# EAGLE schematic core (EAGLE 9.6.2), part 1 of 2
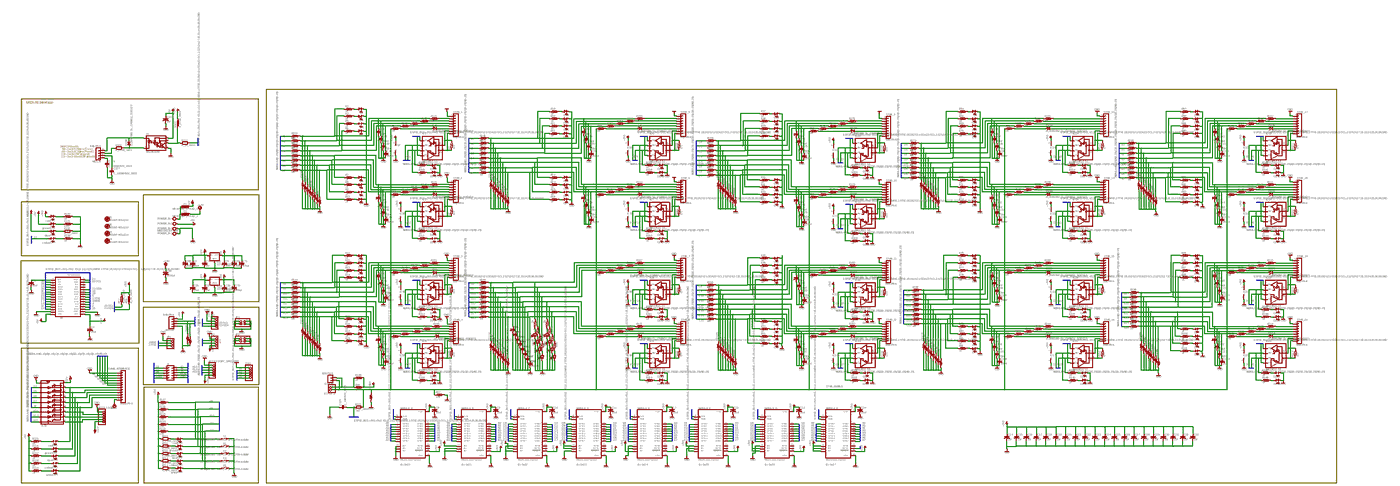
[diagram p0: schematic, sheet 1, overview]
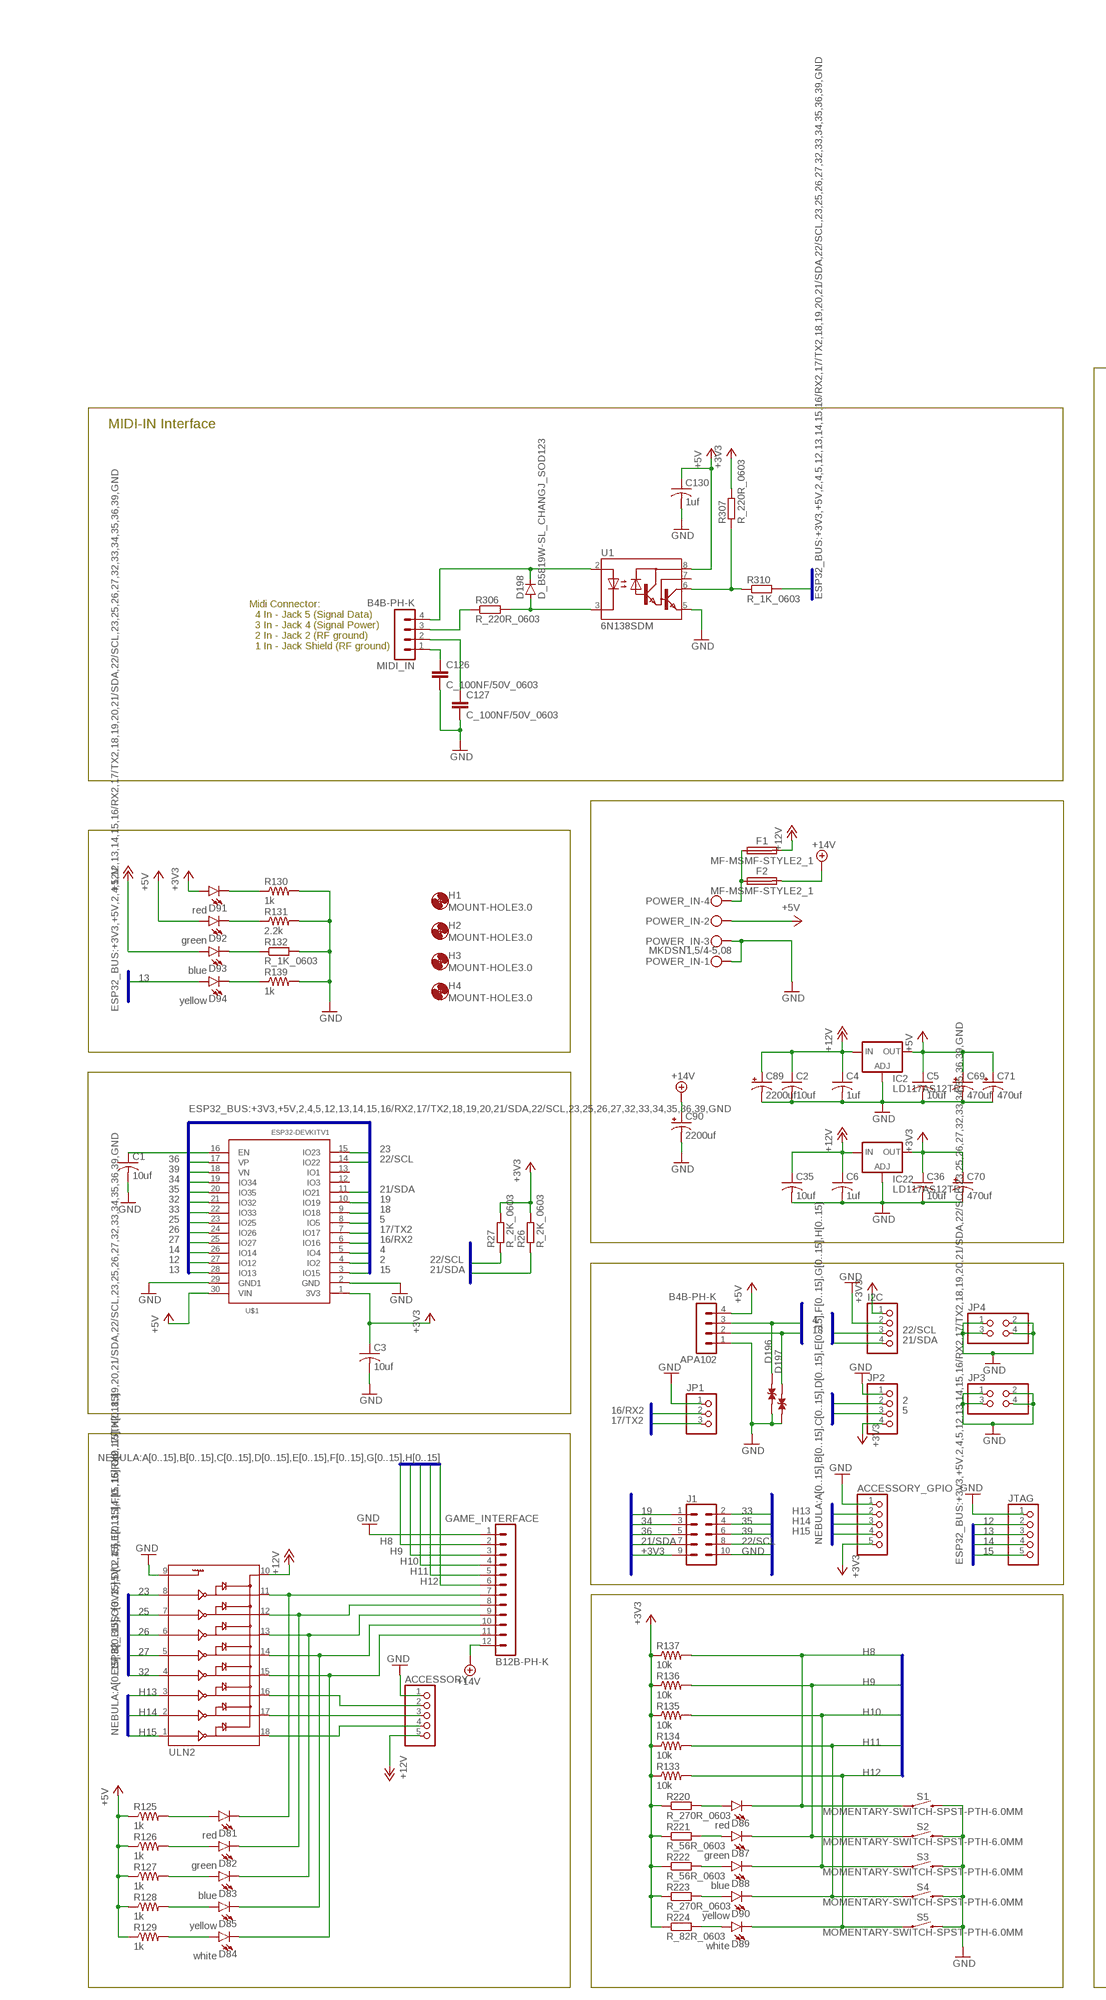
[diagram p1: schematic, sheet 1, part 1 of 4]
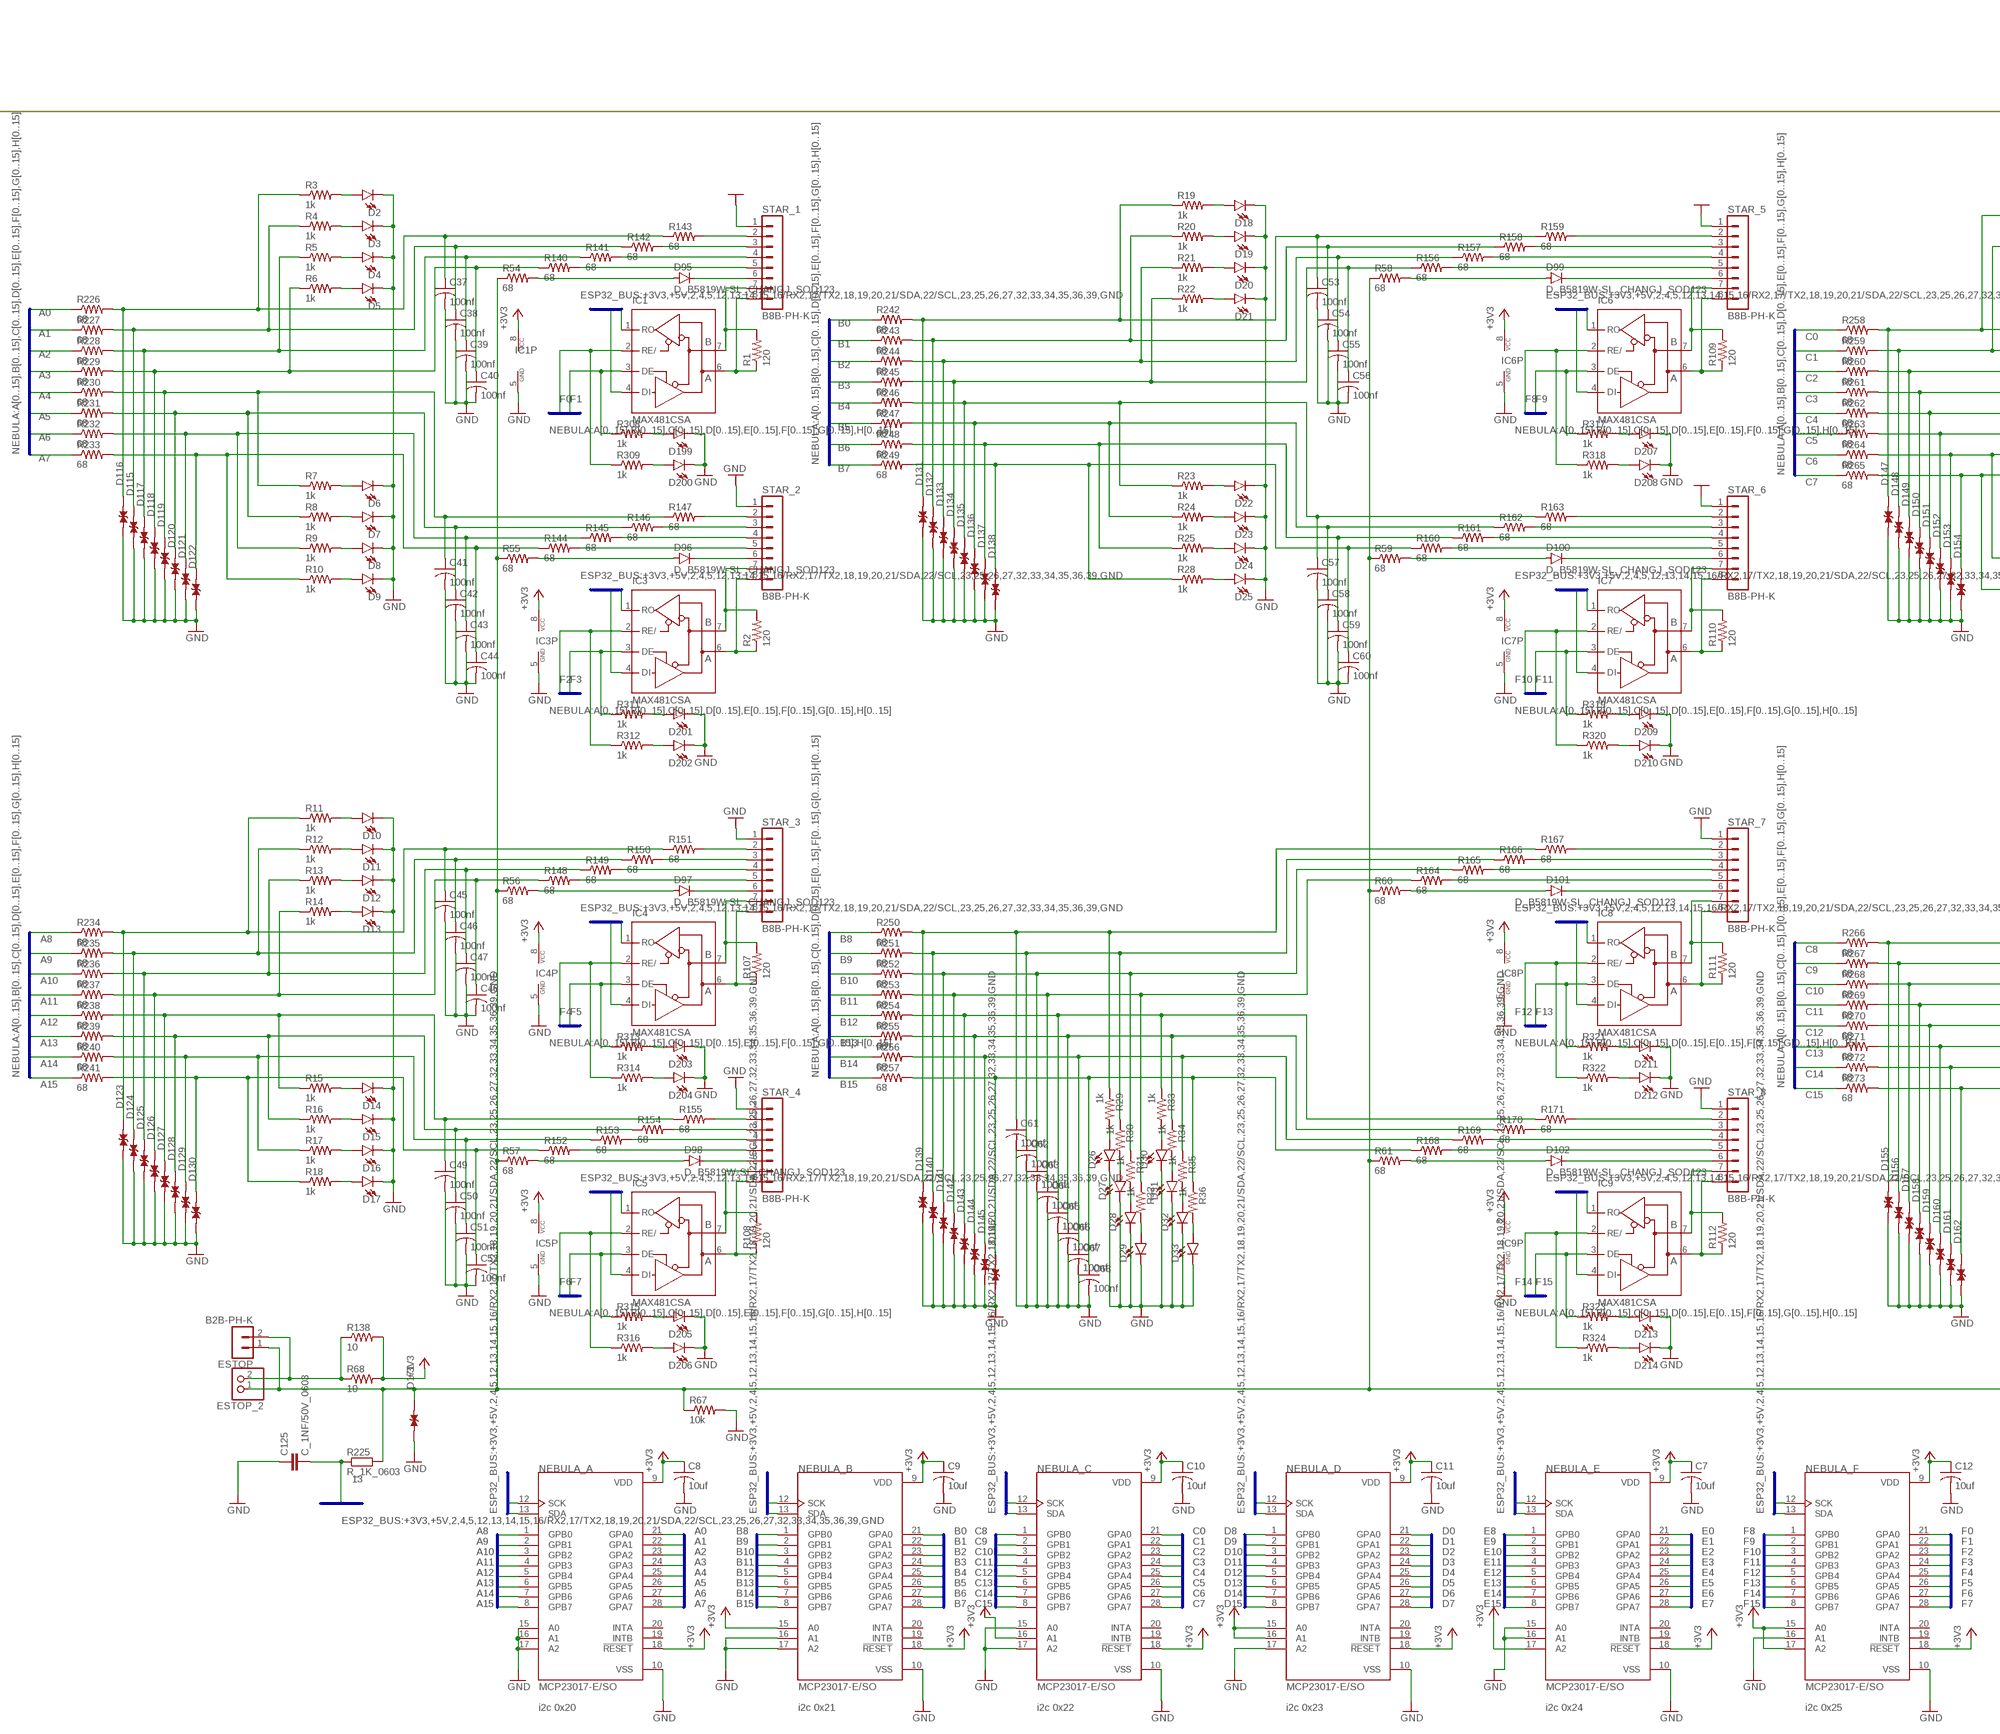
[diagram p2: schematic, sheet 1, part 2 of 4]
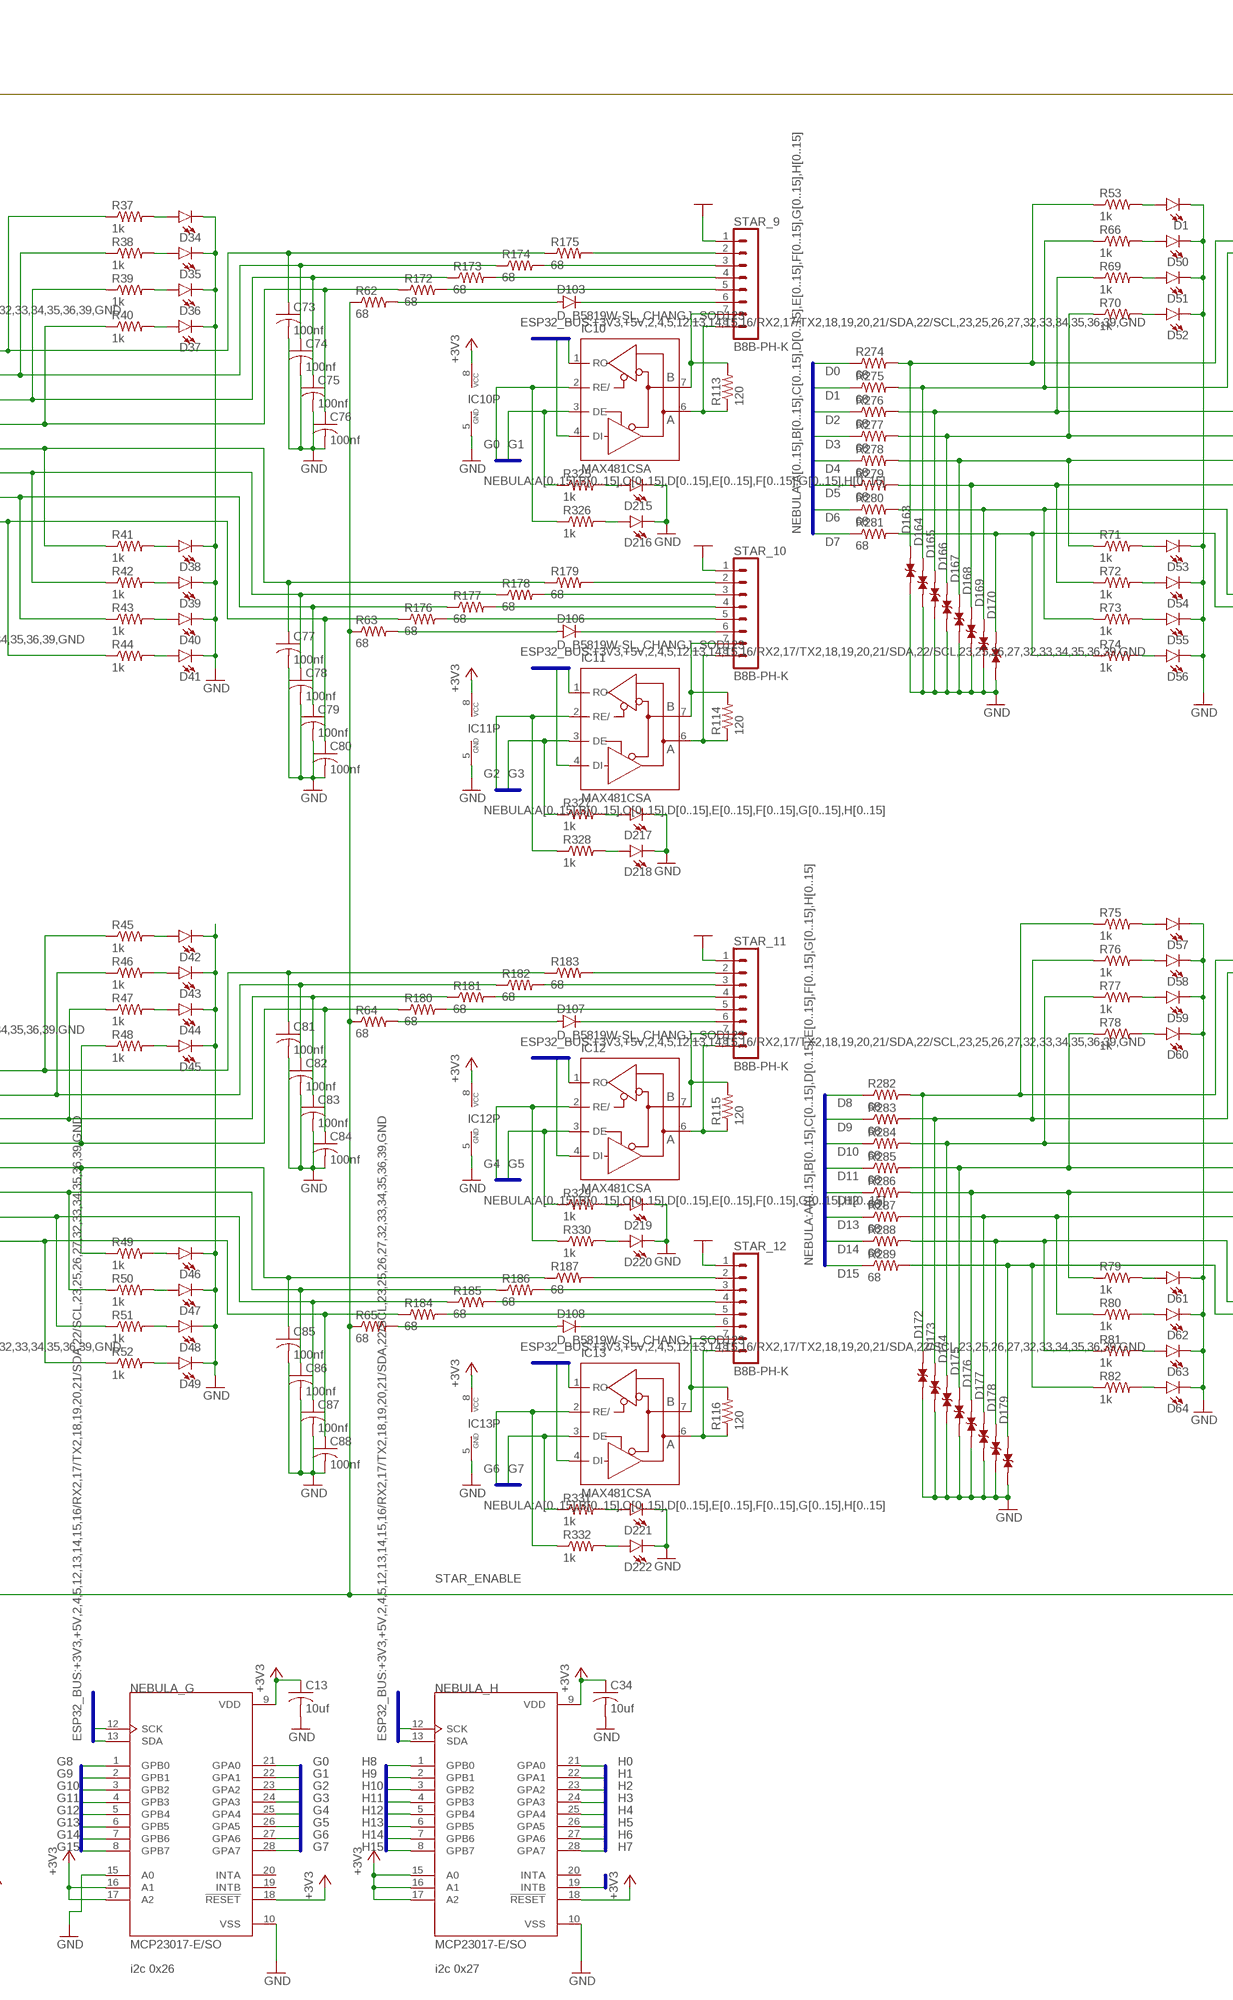
[diagram p3: schematic, sheet 1, part 3 of 4]
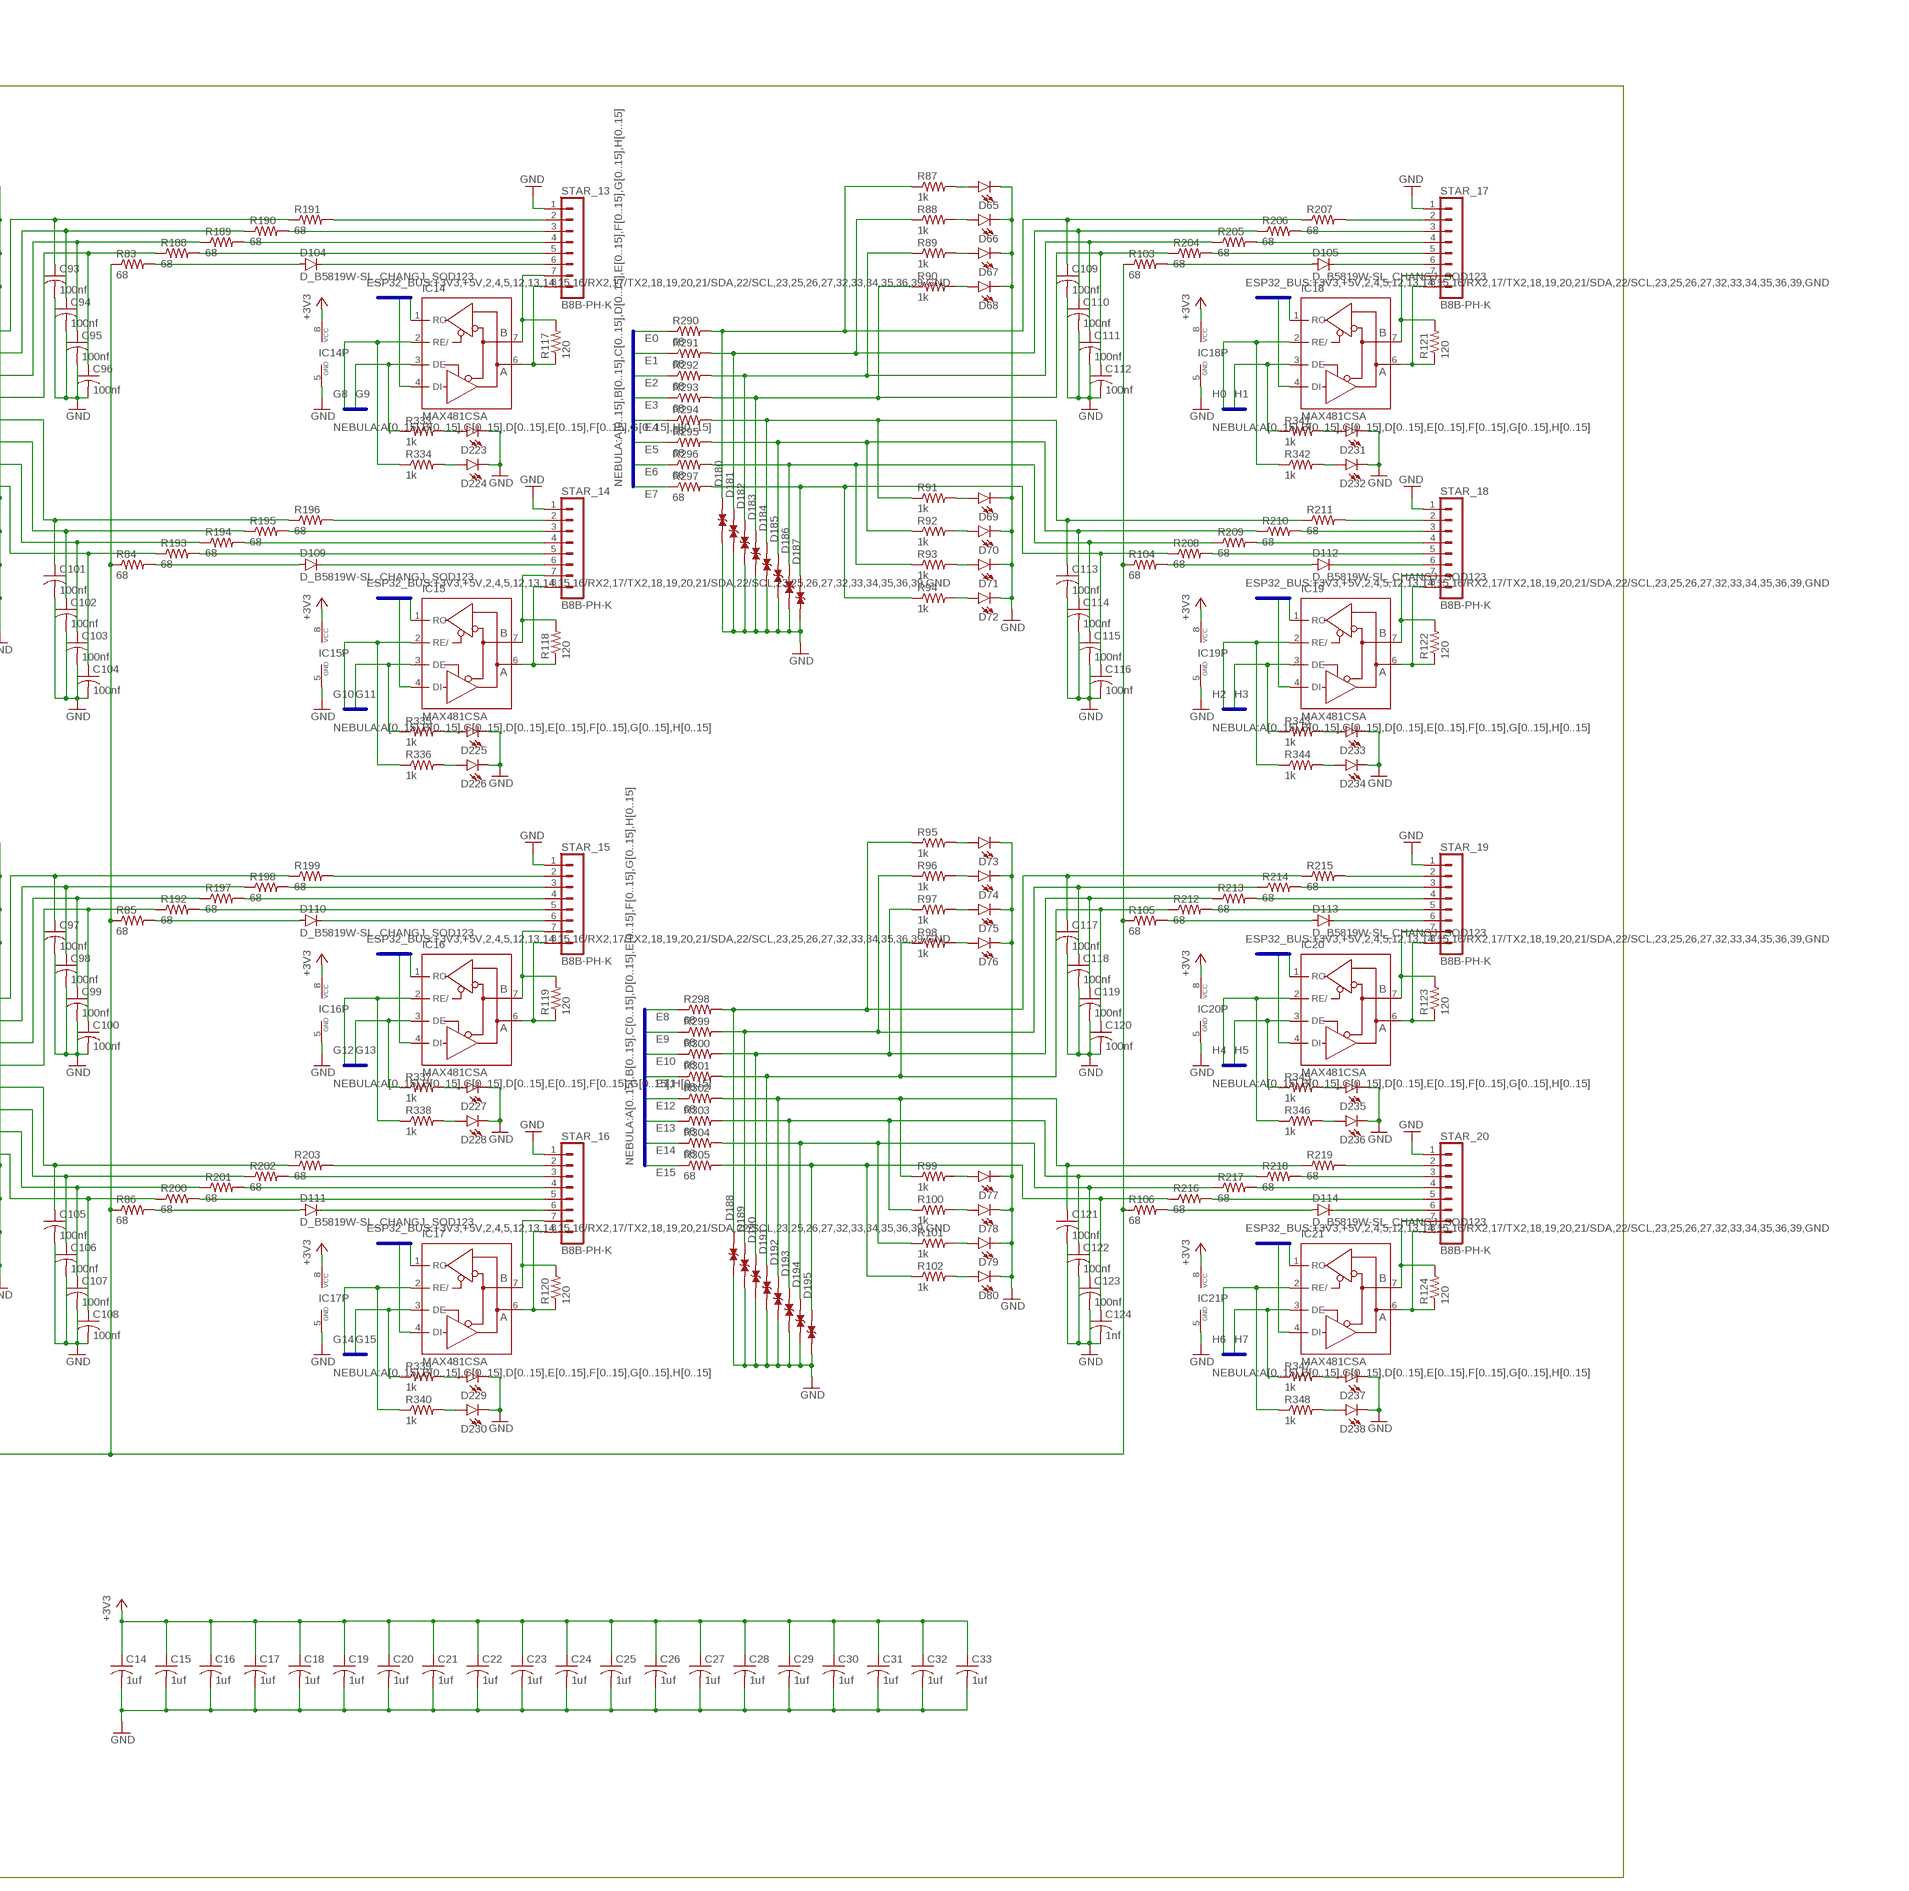
[diagram p4: schematic, sheet 1, part 4 of 4]

## Parts
ACCESSORY  PINHD-1X5  [1X05]
ACCESSORY_GPIO  PINHD-1X5  [1X05]
APA102  B4B-PH-K  [B4B-PH-K]
C1  10uf  C-USC0603  [C0603]
C2  10uf  C-USC0603  [C0603]
C3  10uf  C-USC0603  [C0603]
C4  1uf  C-USC0805  [C0805]
C5  10uf  C-USC0603  [C0603]
C6  1uf  C-USC0805  [C0805]
C7  10uf  C-USC0603  [C0603]
C8  10uf  C-USC0603  [C0603]
C9  10uf  C-USC0603  [C0603]
C10  10uf  C-USC0603  [C0603]
C11  10uf  C-USC0603  [C0603]
C12  10uf  C-USC0603  [C0603]
C13  10uf  C-USC0603  [C0603]
C14  1uf  C-USC0805  [C0805]
C15  1uf  C-USC0805  [C0805]
C16  1uf  C-USC0805  [C0805]
C17  1uf  C-USC0805  [C0805]
C18  1uf  C-USC0805  [C0805]
C19  1uf  C-USC0805  [C0805]
C20  1uf  C-USC0805  [C0805]
C21  1uf  C-USC0805  [C0805]
C22  1uf  C-USC0805  [C0805]
C23  1uf  C-USC0805  [C0805]
C24  1uf  C-USC0805  [C0805]
C25  1uf  C-USC0805  [C0805]
C26  1uf  C-USC0805  [C0805]
C27  1uf  C-USC0805  [C0805]
C28  1uf  C-USC0805  [C0805]
C29  1uf  C-USC0805  [C0805]
C30  1uf  C-USC0805  [C0805]
C31  1uf  C-USC0805  [C0805]
C32  1uf  C-USC0805  [C0805]
C33  1uf  C-USC0805  [C0805]
C34  10uf  C-USC0603  [C0603]
C35  10uf  C-USC0603  [C0603]
C36  10uf  C-USC0603  [C0603]
C37  100nf  C-USC0603  [C0603]
C38  100nf  C-USC0603  [C0603]
C39  100nf  C-USC0603  [C0603]
C40  100nf  C-USC0603  [C0603]
C41  100nf  C-USC0603  [C0603]
C42  100nf  C-USC0603  [C0603]
C43  100nf  C-USC0603  [C0603]
C44  100nf  C-USC0603  [C0603]
C45  100nf  C-USC0603  [C0603]
C46  100nf  C-USC0603  [C0603]
C47  100nf  C-USC0603  [C0603]
C48  100nf  C-USC0603  [C0603]
C49  100nf  C-USC0603  [C0603]
C50  100nf  C-USC0603  [C0603]
C51  100nf  C-USC0603  [C0603]
C52  100nf  C-USC0603  [C0603]
C53  100nf  C-USC0603  [C0603]
C54  100nf  C-USC0603  [C0603]
C55  100nf  C-USC0603  [C0603]
C56  100nf  C-USC0603  [C0603]
C57  100nf  C-USC0603  [C0603]
C58  100nf  C-USC0603  [C0603]
C59  100nf  C-USC0603  [C0603]
C60  100nf  C-USC0603  [C0603]
C61  100nf  C-USC0603  [C0603]
C62  100nf  C-USC0603  [C0603]
C63  100nf  C-USC0603  [C0603]
C64  100nf  C-USC0603  [C0603]
C65  100nf  C-USC0603  [C0603]
C66  100nf  C-USC0603  [C0603]
C67  100nf  C-USC0603  [C0603]
C68  100nf  C-USC0603  [C0603]
C69  470uf  CPOL-USE5-13  [E5-13]
C70  470uf  CPOL-USE5-13  [E5-13]
C71  470uf  CPOL-USE5-13  [E5-13]
C73  100nf  C-USC0603  [C0603]
C74  100nf  C-USC0603  [C0603]
C75  100nf  C-USC0603  [C0603]
C76  100nf  C-USC0603  [C0603]
C77  100nf  C-USC0603  [C0603]
C78  100nf  C-USC0603  [C0603]
C79  100nf  C-USC0603  [C0603]
C80  100nf  C-USC0603  [C0603]
C81  100nf  C-USC0603  [C0603]
C82  100nf  C-USC0603  [C0603]
C83  100nf  C-USC0603  [C0603]
C84  100nf  C-USC0603  [C0603]
C85  100nf  C-USC0603  [C0603]
C86  100nf  C-USC0603  [C0603]
C87  100nf  C-USC0603  [C0603]
C88  100nf  C-USC0603  [C0603]
C89  2200uf  CPOL-USE5-13  [E5-13]
C90  2200uf  CPOL-USE5-13  [E5-13]
C93  100nf  C-USC0603  [C0603]
C94  100nf  C-USC0603  [C0603]
C95  100nf  C-USC0603  [C0603]
C96  100nf  C-USC0603  [C0603]
C97  100nf  C-USC0603  [C0603]
C98  100nf  C-USC0603  [C0603]
C99  100nf  C-USC0603  [C0603]
C100  100nf  C-USC0603  [C0603]
C101  100nf  C-USC0603  [C0603]
C102  100nf  C-USC0603  [C0603]
C103  100nf  C-USC0603  [C0603]
C104  100nf  C-USC0603  [C0603]
C105  100nf  C-USC0603  [C0603]
C106  100nf  C-USC0603  [C0603]
C107  100nf  C-USC0603  [C0603]
C108  100nf  C-USC0603  [C0603]
C109  100nf  C-USC0603  [C0603]
C110  100nf  C-USC0603  [C0603]
C111  100nf  C-USC0603  [C0603]
C112  100nf  C-USC0603  [C0603]
C113  100nf  C-USC0603  [C0603]
C114  100nf  C-USC0603  [C0603]
C115  100nf  C-USC0603  [C0603]
C116  100nf  C-USC0603  [C0603]
C117  100nf  C-USC0603  [C0603]
C118  100nf  C-USC0603  [C0603]
C119  100nf  C-USC0603  [C0603]
C120  100nf  C-USC0603  [C0603]
C121  100nf  C-USC0603  [C0603]
C122  100nf  C-USC0603  [C0603]
C123  100nf  C-USC0603  [C0603]
C124  1nf  C-USC0603  [C0603]
C125  C_1NF/50V_0603  [C0603]
C126  C_100NF/50V_0603  [C0603]
C127  C_100NF/50V_0603  [C0603]
C130  1uf  C-USC0805  [C0805]
D1  LED0603  [LED-0603]
D2  LED0603  [LED-0603]
D3  LED0603  [LED-0603]
D4  LED0603  [LED-0603]
D5  LED0603  [LED-0603]
D6  LED0603  [LED-0603]
D7  LED0603  [LED-0603]
D8  LED0603  [LED-0603]
D9  LED0603  [LED-0603]
D10  LED0603  [LED-0603]
D11  LED0603  [LED-0603]
D12  LED0603  [LED-0603]
D13  LED0603  [LED-0603]
D14  LED0603  [LED-0603]
D15  LED0603  [LED-0603]
D16  LED0603  [LED-0603]
D17  LED0603  [LED-0603]
D18  LED0603  [LED-0603]
D19  LED0603  [LED-0603]
D20  LED0603  [LED-0603]
D21  LED0603  [LED-0603]
D22  LED0603  [LED-0603]
D23  LED0603  [LED-0603]
D24  LED0603  [LED-0603]
D25  LED0603  [LED-0603]
D26  LED0603  [LED-0603]
D27  LED0603  [LED-0603]
D28  LED0603  [LED-0603]
D29  LED0603  [LED-0603]
D30  LED0603  [LED-0603]
D31  LED0603  [LED-0603]
D32  LED0603  [LED-0603]
D33  LED0603  [LED-0603]
D34  LED0603  [LED-0603]
D35  LED0603  [LED-0603]
D36  LED0603  [LED-0603]
D37  LED0603  [LED-0603]
D38  LED0603  [LED-0603]
D39  LED0603  [LED-0603]
D40  LED0603  [LED-0603]
D41  LED0603  [LED-0603]
D42  LED0603  [LED-0603]
D43  LED0603  [LED-0603]
D44  LED0603  [LED-0603]
D45  LED0603  [LED-0603]
D46  LED0603  [LED-0603]
D47  LED0603  [LED-0603]
D48  LED0603  [LED-0603]
D49  LED0603  [LED-0603]
D50  LED0603  [LED-0603]
D51  LED0603  [LED-0603]
D52  LED0603  [LED-0603]
D53  LED0603  [LED-0603]
D54  LED0603  [LED-0603]
D55  LED0603  [LED-0603]
D56  LED0603  [LED-0603]
D57  LED0603  [LED-0603]
D58  LED0603  [LED-0603]
D59  LED0603  [LED-0603]
D60  LED0603  [LED-0603]
D61  LED0603  [LED-0603]
D62  LED0603  [LED-0603]
D63  LED0603  [LED-0603]
D64  LED0603  [LED-0603]
D65  LED0603  [LED-0603]
D66  LED0603  [LED-0603]
D67  LED0603  [LED-0603]
D68  LED0603  [LED-0603]
D69  LED0603  [LED-0603]
D70  LED0603  [LED-0603]
D71  LED0603  [LED-0603]
D72  LED0603  [LED-0603]
D73  LED0603  [LED-0603]
D74  LED0603  [LED-0603]
D75  LED0603  [LED-0603]
D76  LED0603  [LED-0603]
D77  LED0603  [LED-0603]
D78  LED0603  [LED-0603]
D79  LED0603  [LED-0603]
D80  LED0603  [LED-0603]
D81  red  LED0603  [LED-0603]
D82  green  LED0603  [LED-0603]
D83  blue  LED0603  [LED-0603]
D84  white  LED0603  [LED-0603]
D85  yellow  LED0603  [LED-0603]
D86  red  LED0603  [LED-0603]
D87  green  LED0603  [LED-0603]
D88  blue  LED0603  [LED-0603]
D89  white  LED0603  [LED-0603]
D90  yellow  LED0603  [LED-0603]
D91  red  LED0603  [LED-0603]
D92  green  LED0603  [LED-0603]
D93  blue  LED0603  [LED-0603]
D94  yellow  LED0603  [LED-0603]
D95  D_B5819W-SL_CHANGJ_SOD123  [SOD123]
D96  D_B5819W-SL_CHANGJ_SOD123  [SOD123]
D97  D_B5819W-SL_CHANGJ_SOD123  [SOD123]
D98  D_B5819W-SL_CHANGJ_SOD123  [SOD123]
D99  D_B5819W-SL_CHANGJ_SOD123  [SOD123]
D100  D_B5819W-SL_CHANGJ_SOD123  [SOD123]
D101  D_B5819W-SL_CHANGJ_SOD123  [SOD123]
D102  D_B5819W-SL_CHANGJ_SOD123  [SOD123]
D103  D_B5819W-SL_CHANGJ_SOD123  [SOD123]
D104  D_B5819W-SL_CHANGJ_SOD123  [SOD123]
D105  D_B5819W-SL_CHANGJ_SOD123  [SOD123]
D106  D_B5819W-SL_CHANGJ_SOD123  [SOD123]
D107  D_B5819W-SL_CHANGJ_SOD123  [SOD123]
D108  D_B5819W-SL_CHANGJ_SOD123  [SOD123]
D109  D_B5819W-SL_CHANGJ_SOD123  [SOD123]
D110  D_B5819W-SL_CHANGJ_SOD123  [SOD123]
D111  D_B5819W-SL_CHANGJ_SOD123  [SOD123]
D112  D_B5819W-SL_CHANGJ_SOD123  [SOD123]
D113  D_B5819W-SL_CHANGJ_SOD123  [SOD123]
D114  D_B5819W-SL_CHANGJ_SOD123  [SOD123]
D115  SMBJ8.0CA  [DIOM4336X265N]
D116  SMBJ8.0CA  [DIOM4336X265N]
D117  SMBJ8.0CA  [DIOM4336X265N]
D118  SMBJ8.0CA  [DIOM4336X265N]
D119  SMBJ8.0CA  [DIOM4336X265N]
D120  SMBJ8.0CA  [DIOM4336X265N]
D121  SMBJ8.0CA  [DIOM4336X265N]
D122  SMBJ8.0CA  [DIOM4336X265N]
D123  SMBJ8.0CA  [DIOM4336X265N]
D124  SMBJ8.0CA  [DIOM4336X265N]
D125  SMBJ8.0CA  [DIOM4336X265N]
D126  SMBJ8.0CA  [DIOM4336X265N]
D127  SMBJ8.0CA  [DIOM4336X265N]
D128  SMBJ8.0CA  [DIOM4336X265N]
D129  SMBJ8.0CA  [DIOM4336X265N]
D130  SMBJ8.0CA  [DIOM4336X265N]
D131  SMBJ8.0CA  [DIOM4336X265N]
D132  SMBJ8.0CA  [DIOM4336X265N]
D133  SMBJ8.0CA  [DIOM4336X265N]
D134  SMBJ8.0CA  [DIOM4336X265N]
D135  SMBJ8.0CA  [DIOM4336X265N]
D136  SMBJ8.0CA  [DIOM4336X265N]
D137  SMBJ8.0CA  [DIOM4336X265N]
D138  SMBJ8.0CA  [DIOM4336X265N]
D139  SMBJ8.0CA  [DIOM4336X265N]
D140  SMBJ8.0CA  [DIOM4336X265N]
D141  SMBJ8.0CA  [DIOM4336X265N]
D142  SMBJ8.0CA  [DIOM4336X265N]
D143  SMBJ8.0CA  [DIOM4336X265N]
D144  SMBJ8.0CA  [DIOM4336X265N]
D145  SMBJ8.0CA  [DIOM4336X265N]
D146  SMBJ8.0CA  [DIOM4336X265N]
D147  SMBJ8.0CA  [DIOM4336X265N]
D148  SMBJ8.0CA  [DIOM4336X265N]
D149  SMBJ8.0CA  [DIOM4336X265N]
D150  SMBJ8.0CA  [DIOM4336X265N]
D151  SMBJ8.0CA  [DIOM4336X265N]
D152  SMBJ8.0CA  [DIOM4336X265N]
D153  SMBJ8.0CA  [DIOM4336X265N]
D154  SMBJ8.0CA  [DIOM4336X265N]
D155  SMBJ8.0CA  [DIOM4336X265N]
D156  SMBJ8.0CA  [DIOM4336X265N]
D157  SMBJ8.0CA  [DIOM4336X265N]
D158  SMBJ8.0CA  [DIOM4336X265N]
D159  SMBJ8.0CA  [DIOM4336X265N]
D160  SMBJ8.0CA  [DIOM4336X265N]
D161  SMBJ8.0CA  [DIOM4336X265N]
D162  SMBJ8.0CA  [DIOM4336X265N]
D163  SMBJ8.0CA  [DIOM4336X265N]
D164  SMBJ8.0CA  [DIOM4336X265N]
D165  SMBJ8.0CA  [DIOM4336X265N]
D166  SMBJ8.0CA  [DIOM4336X265N]
D167  SMBJ8.0CA  [DIOM4336X265N]
D168  SMBJ8.0CA  [DIOM4336X265N]
D169  SMBJ8.0CA  [DIOM4336X265N]
D170  SMBJ8.0CA  [DIOM4336X265N]
D171  SMBJ8.0CA  [DIOM4336X265N]
D172  SMBJ8.0CA  [DIOM4336X265N]
D173  SMBJ8.0CA  [DIOM4336X265N]
D174  SMBJ8.0CA  [DIOM4336X265N]
D175  SMBJ8.0CA  [DIOM4336X265N]
D176  SMBJ8.0CA  [DIOM4336X265N]
D177  SMBJ8.0CA  [DIOM4336X265N]
D178  SMBJ8.0CA  [DIOM4336X265N]
D179  SMBJ8.0CA  [DIOM4336X265N]
D180  SMBJ8.0CA  [DIOM4336X265N]
D181  SMBJ8.0CA  [DIOM4336X265N]
D182  SMBJ8.0CA  [DIOM4336X265N]
D183  SMBJ8.0CA  [DIOM4336X265N]
D184  SMBJ8.0CA  [DIOM4336X265N]
D185  SMBJ8.0CA  [DIOM4336X265N]
D186  SMBJ8.0CA  [DIOM4336X265N]
D187  SMBJ8.0CA  [DIOM4336X265N]
D188  SMBJ8.0CA  [DIOM4336X265N]
D189  SMBJ8.0CA  [DIOM4336X265N]
D190  SMBJ8.0CA  [DIOM4336X265N]
D191  SMBJ8.0CA  [DIOM4336X265N]
D192  SMBJ8.0CA  [DIOM4336X265N]
D193  SMBJ8.0CA  [DIOM4336X265N]
D194  SMBJ8.0CA  [DIOM4336X265N]
D195  SMBJ8.0CA  [DIOM4336X265N]
D196  SMBJ8.0CA  [DIOM4336X265N]
D197  SMBJ8.0CA  [DIOM4336X265N]
D198  D_B5819W-SL_CHANGJ_SOD123  [SOD123]
D199  LED0603  [LED-0603]
D200  LED0603  [LED-0603]
D201  LED0603  [LED-0603]
D202  LED0603  [LED-0603]
D203  LED0603  [LED-0603]
D204  LED0603  [LED-0603]
D205  LED0603  [LED-0603]
D206  LED0603  [LED-0603]
D207  LED0603  [LED-0603]
D208  LED0603  [LED-0603]
D209  LED0603  [LED-0603]
D210  LED0603  [LED-0603]
D211  LED0603  [LED-0603]
D212  LED0603  [LED-0603]
D213  LED0603  [LED-0603]
D214  LED0603  [LED-0603]
D215  LED0603  [LED-0603]
D216  LED0603  [LED-0603]
D217  LED0603  [LED-0603]
D218  LED0603  [LED-0603]
D219  LED0603  [LED-0603]
D220  LED0603  [LED-0603]
D221  LED0603  [LED-0603]
D222  LED0603  [LED-0603]
D223  LED0603  [LED-0603]
D224  LED0603  [LED-0603]
D225  LED0603  [LED-0603]
D226  LED0603  [LED-0603]
D227  LED0603  [LED-0603]
D228  LED0603  [LED-0603]
D229  LED0603  [LED-0603]
D230  LED0603  [LED-0603]
D231  LED0603  [LED-0603]
D232  LED0603  [LED-0603]
D233  LED0603  [LED-0603]
D234  LED0603  [LED-0603]
D235  LED0603  [LED-0603]
D236  LED0603  [LED-0603]
D237  LED0603  [LED-0603]
D238  LED0603  [LED-0603]
ESTOP  B2B-PH-K  [B2B-PH-K]
ESTOP_2  PINHD-1X2  [1X02]
F1  MF-MSMF-STYLE2_1  [FUSC4632X160]
F2  MF-MSMF-STYLE2_1  [FUSC4632X160]
GAME_INTERFACE  B12B-PH-K  [B12B-PH-K]
H1  MOUNT-HOLE3.0  [3,0]
H2  MOUNT-HOLE3.0  [3,0]
H3  MOUNT-HOLE3.0  [3,0]
H4  MOUNT-HOLE3.0  [3,0]
I2C  PINHD-1X4  [1X04]
IC1  MAX481CSA  [SO08]
IC2  LD117AS12TR  [SOT223]
IC3  MAX481CSA  [SO08]
IC4  MAX481CSA  [SO08]
IC5  MAX481CSA  [SO08]
IC6  MAX481CSA  [SO08]
IC7  MAX481CSA  [SO08]
IC8  MAX481CSA  [SO08]
IC9  MAX481CSA  [SO08]
IC10  MAX481CSA  [SO08]
IC11  MAX481CSA  [SO08]
IC12  MAX481CSA  [SO08]
IC13  MAX481CSA  [SO08]
IC14  MAX481CSA  [SO08]
IC15  MAX481CSA  [SO08]
IC16  MAX481CSA  [SO08]
IC17  MAX481CSA  [SO08]
IC18  MAX481CSA  [SO08]
IC19  MAX481CSA  [SO08]
IC20  MAX481CSA  [SO08]
IC21  MAX481CSA  [SO08]
IC22  LD117AS12TR  [SOT223]
J1  CONN_05X2SHD  [2X5-SHROUDED]
JP1  PINHD-1X3  [1X03]
JP2  PINHD-1X4  [1X04]
JP3  PINHD-2X2  [2X02]
JP4  PINHD-2X2  [2X02]
JTAG  PINHD-1X5  [1X05]
MIDI_IN  B4B-PH-K  [B4B-PH-K]
NEBULA_A  MCP23017-E/SO  [SOIC127P1030X265-28N]
NEBULA_B  MCP23017-E/SO  [SOIC127P1030X265-28N]
NEBULA_C  MCP23017-E/SO  [SOIC127P1030X265-28N]
NEBULA_D  MCP23017-E/SO  [SOIC127P1030X265-28N]
NEBULA_E  MCP23017-E/SO  [SOIC127P1030X265-28N]
NEBULA_F  MCP23017-E/SO  [SOIC127P1030X265-28N]
NEBULA_G  MCP23017-E/SO  [SOIC127P1030X265-28N]
NEBULA_H  MCP23017-E/SO  [SOIC127P1030X265-28N]
POWER_IN  MKDSN1,5/4-5,08  [MKDSN1,5/4-5,08]
R1  120  R-US_R0603  [R0603]
R2  120  R-US_R0603  [R0603]
R3  1k  R-US_R0603  [R0603]
R4  1k  R-US_R0603  [R0603]
R5  1k  R-US_R0603  [R0603]
R6  1k  R-US_R0603  [R0603]
R7  1k  R-US_R0603  [R0603]
R8  1k  R-US_R0603  [R0603]
R9  1k  R-US_R0603  [R0603]
R10  1k  R-US_R0603  [R0603]
R11  1k  R-US_R0603  [R0603]
R12  1k  R-US_R0603  [R0603]
R13  1k  R-US_R0603  [R0603]
R14  1k  R-US_R0603  [R0603]
R15  1k  R-US_R0603  [R0603]
R16  1k  R-US_R0603  [R0603]
R17  1k  R-US_R0603  [R0603]
R18  1k  R-US_R0603  [R0603]
R19  1k  R-US_R0603  [R0603]
R20  1k  R-US_R0603  [R0603]
R21  1k  R-US_R0603  [R0603]
R22  1k  R-US_R0603  [R0603]
R23  1k  R-US_R0603  [R0603]
R24  1k  R-US_R0603  [R0603]
R25  1k  R-US_R0603  [R0603]
R26  R_2K_0603  [R0603]
R27  R_2K_0603  [R0603]
R28  1k  R-US_R0603  [R0603]
R29  1k  R-US_R0603  [R0603]
R30  1k  R-US_R0603  [R0603]
R31  1k  R-US_R0603  [R0603]
R32  1k  R-US_R0603  [R0603]
R33  1k  R-US_R0603  [R0603]
R34  1k  R-US_R0603  [R0603]
R35  1k  R-US_R0603  [R0603]
R36  1k  R-US_R0603  [R0603]
R37  1k  R-US_R0603  [R0603]
R38  1k  R-US_R0603  [R0603]
R39  1k  R-US_R0603  [R0603]
R40  1k  R-US_R0603  [R0603]
R41  1k  R-US_R0603  [R0603]
R42  1k  R-US_R0603  [R0603]
R43  1k  R-US_R0603  [R0603]
R44  1k  R-US_R0603  [R0603]
R45  1k  R-US_R0603  [R0603]
R46  1k  R-US_R0603  [R0603]
R47  1k  R-US_R0603  [R0603]
R48  1k  R-US_R0603  [R0603]
R49  1k  R-US_R0603  [R0603]
R50  1k  R-US_R0603  [R0603]
R51  1k  R-US_R0603  [R0603]
R52  1k  R-US_R0603  [R0603]
R53  1k  R-US_R0603  [R0603]
R54  68  R-US_R0603  [R0603]
R55  68  R-US_R0603  [R0603]
R56  68  R-US_R0603  [R0603]
R57  68  R-US_R0603  [R0603]
R58  68  R-US_R0603  [R0603]
R59  68  R-US_R0603  [R0603]
R60  68  R-US_R0603  [R0603]
R61  68  R-US_R0603  [R0603]
R62  68  R-US_R0603  [R0603]
R63  68  R-US_R0603  [R0603]
R64  68  R-US_R0603  [R0603]
R65  68  R-US_R0603  [R0603]
R66  1k  R-US_R0603  [R0603]
R67  10k  R-US_R0603  [R0603]
R68  10  R-US_R1206  [R1206]
R69  1k  R-US_R0603  [R0603]
R70  1k  R-US_R0603  [R0603]
R71  1k  R-US_R0603  [R0603]
R72  1k  R-US_R0603  [R0603]
R73  1k  R-US_R0603  [R0603]
R74  1k  R-US_R0603  [R0603]
R75  1k  R-US_R0603  [R0603]
R76  1k  R-US_R0603  [R0603]
R77  1k  R-US_R0603  [R0603]
R78  1k  R-US_R0603  [R0603]
R79  1k  R-US_R0603  [R0603]
R80  1k  R-US_R0603  [R0603]
R81  1k  R-US_R0603  [R0603]
R82  1k  R-US_R0603  [R0603]
R83  68  R-US_R0603  [R0603]
R84  68  R-US_R0603  [R0603]
R85  68  R-US_R0603  [R0603]
R86  68  R-US_R0603  [R0603]
R87  1k  R-US_R0603  [R0603]
R88  1k  R-US_R0603  [R0603]
R89  1k  R-US_R0603  [R0603]
R90  1k  R-US_R0603  [R0603]
R91  1k  R-US_R0603  [R0603]
R92  1k  R-US_R0603  [R0603]
R93  1k  R-US_R0603  [R0603]
R94  1k  R-US_R0603  [R0603]
R95  1k  R-US_R0603  [R0603]
R96  1k  R-US_R0603  [R0603]
R97  1k  R-US_R0603  [R0603]
R98  1k  R-US_R0603  [R0603]
R99  1k  R-US_R0603  [R0603]
R100  1k  R-US_R0603  [R0603]
R101  1k  R-US_R0603  [R0603]
R102  1k  R-US_R0603  [R0603]
R103  68  R-US_R0603  [R0603]
R104  68  R-US_R0603  [R0603]
R105  68  R-US_R0603  [R0603]
R106  68  R-US_R0603  [R0603]
R107  120  R-US_R0603  [R0603]
R108  120  R-US_R0603  [R0603]
R109  120  R-US_R0603  [R0603]
R110  120  R-US_R0603  [R0603]
R111  120  R-US_R0603  [R0603]
R112  120  R-US_R0603  [R0603]
R113  120  R-US_R0603  [R0603]
R114  120  R-US_R0603  [R0603]
R115  120  R-US_R0603  [R0603]
R116  120  R-US_R0603  [R0603]
R117  120  R-US_R0603  [R0603]
R118  120  R-US_R0603  [R0603]
R119  120  R-US_R0603  [R0603]
R120  120  R-US_R0603  [R0603]
R121  120  R-US_R0603  [R0603]
R122  120  R-US_R0603  [R0603]
R123  120  R-US_R0603  [R0603]
R124  120  R-US_R0603  [R0603]
R125  1k  R-US_R0603  [R0603]
R126  1k  R-US_R0603  [R0603]
R127  1k  R-US_R0603  [R0603]
R128  1k  R-US_R0603  [R0603]
R129  1k  R-US_R0603  [R0603]
R130  1k  R-US_R0603  [R0603]
R131  2.2k  R-US_R0603  [R0603]
R132  R_1K_0603  [R0603]
R133  10k  R-US_R0603  [R0603]
R134  10k  R-US_R0603  [R0603]
R135  10k  R-US_R0603  [R0603]
R136  10k  R-US_R0603  [R0603]
R137  10k  R-US_R0603  [R0603]
R138  10  R-US_R1206  [R1206]
R139  1k  R-US_R0603  [R0603]
R140  68  R-US_R0603  [R0603]
R141  68  R-US_R0603  [R0603]
R142  68  R-US_R0603  [R0603]
R143  68  R-US_R0603  [R0603]
R144  68  R-US_R0603  [R0603]
R145  68  R-US_R0603  [R0603]
R146  68  R-US_R0603  [R0603]
R147  68  R-US_R0603  [R0603]
R148  68  R-US_R0603  [R0603]
R149  68  R-US_R0603  [R0603]
R150  68  R-US_R0603  [R0603]
R151  68  R-US_R0603  [R0603]
R152  68  R-US_R0603  [R0603]
R153  68  R-US_R0603  [R0603]
R154  68  R-US_R0603  [R0603]
R155  68  R-US_R0603  [R0603]
R156  68  R-US_R0603  [R0603]
R157  68  R-US_R0603  [R0603]
R158  68  R-US_R0603  [R0603]
R159  68  R-US_R0603  [R0603]
R160  68  R-US_R0603  [R0603]
R161  68  R-US_R0603  [R0603]
R162  68  R-US_R0603  [R0603]
R163  68  R-US_R0603  [R0603]
R164  68  R-US_R0603  [R0603]
R165  68  R-US_R0603  [R0603]
R166  68  R-US_R0603  [R0603]
R167  68  R-US_R0603  [R0603]
R168  68  R-US_R0603  [R0603]
R169  68  R-US_R0603  [R0603]
R170  68  R-US_R0603  [R0603]
R171  68  R-US_R0603  [R0603]
R172  68  R-US_R0603  [R0603]
R173  68  R-US_R0603  [R0603]
R174  68  R-US_R0603  [R0603]
R175  68  R-US_R0603  [R0603]
R176  68  R-US_R0603  [R0603]
R177  68  R-US_R0603  [R0603]
R178  68  R-US_R0603  [R0603]
R179  68  R-US_R0603  [R0603]
R180  68  R-US_R0603  [R0603]
R181  68  R-US_R0603  [R0603]
R182  68  R-US_R0603  [R0603]
R183  68  R-US_R0603  [R0603]
R184  68  R-US_R0603  [R0603]
R185  68  R-US_R0603  [R0603]
R186  68  R-US_R0603  [R0603]
R187  68  R-US_R0603  [R0603]
R188  68  R-US_R0603  [R0603]
R189  68  R-US_R0603  [R0603]
R190  68  R-US_R0603  [R0603]
R191  68  R-US_R0603  [R0603]
R192  68  R-US_R0603  [R0603]
R193  68  R-US_R0603  [R0603]
R194  68  R-US_R0603  [R0603]
R195  68  R-US_R0603  [R0603]
R196  68  R-US_R0603  [R0603]
R197  68  R-US_R0603  [R0603]
R198  68  R-US_R0603  [R0603]
R199  68  R-US_R0603  [R0603]
R200  68  R-US_R0603  [R0603]
R201  68  R-US_R0603  [R0603]
R202  68  R-US_R0603  [R0603]
R203  68  R-US_R0603  [R0603]
R204  68  R-US_R0603  [R0603]
R205  68  R-US_R0603  [R0603]
R206  68  R-US_R0603  [R0603]
R207  68  R-US_R0603  [R0603]
R208  68  R-US_R0603  [R0603]
R209  68  R-US_R0603  [R0603]
R210  68  R-US_R0603  [R0603]
R211  68  R-US_R0603  [R0603]
R212  68  R-US_R0603  [R0603]
R213  68  R-US_R0603  [R0603]
R214  68  R-US_R0603  [R0603]
R215  68  R-US_R0603  [R0603]
R216  68  R-US_R0603  [R0603]
R217  68  R-US_R0603  [R0603]
R218  68  R-US_R0603  [R0603]
R219  68  R-US_R0603  [R0603]
R220  R_270R_0603  [R0603]
R221  R_56R_0603  [R0603]
R222  R_56R_0603  [R0603]
R223  R_270R_0603  [R0603]
R224  R_82R_0603  [R0603]
R225  R_1K_0603  [R0603]
R226  68  R-US_R0603  [R0603]
R227  68  R-US_R0603  [R0603]
R228  68  R-US_R0603  [R0603]
R229  68  R-US_R0603  [R0603]
R230  68  R-US_R0603  [R0603]
R231  68  R-US_R0603  [R0603]
R232  68  R-US_R0603  [R0603]
R233  68  R-US_R0603  [R0603]
R234  68  R-US_R0603  [R0603]
R235  68  R-US_R0603  [R0603]
R236  68  R-US_R0603  [R0603]
R237  68  R-US_R0603  [R0603]
R238  68  R-US_R0603  [R0603]
R239  68  R-US_R0603  [R0603]
R240  68  R-US_R0603  [R0603]
R241  68  R-US_R0603  [R0603]
R242  68  R-US_R0603  [R0603]
R243  68  R-US_R0603  [R0603]
R244  68  R-US_R0603  [R0603]
R245  68  R-US_R0603  [R0603]
R246  68  R-US_R0603  [R0603]
R247  68  R-US_R0603  [R0603]
R248  68  R-US_R0603  [R0603]
R249  68  R-US_R0603  [R0603]
R250  68  R-US_R0603  [R0603]
R251  68  R-US_R0603  [R0603]
R252  68  R-US_R0603  [R0603]
R253  68  R-US_R0603  [R0603]
R254  68  R-US_R0603  [R0603]
R255  68  R-US_R0603  [R0603]
R256  68  R-US_R0603  [R0603]
R257  68  R-US_R0603  [R0603]
R258  68  R-US_R0603  [R0603]
R259  68  R-US_R0603  [R0603]
R260  68  R-US_R0603  [R0603]
R261  68  R-US_R0603  [R0603]
R262  68  R-US_R0603  [R0603]
R263  68  R-US_R0603  [R0603]
R264  68  R-US_R0603  [R0603]
R265  68  R-US_R0603  [R0603]
R266  68  R-US_R0603  [R0603]
R267  68  R-US_R0603  [R0603]
R268  68  R-US_R0603  [R0603]
R269  68  R-US_R0603  [R0603]
R270  68  R-US_R0603  [R0603]
R271  68  R-US_R0603  [R0603]
R272  68  R-US_R0603  [R0603]
R273  68  R-US_R0603  [R0603]
R274  68  R-US_R0603  [R0603]
R275  68  R-US_R0603  [R0603]
R276  68  R-US_R0603  [R0603]
R277  68  R-US_R0603  [R0603]
R278  68  R-US_R0603  [R0603]
R279  68  R-US_R0603  [R0603]
R280  68  R-US_R0603  [R0603]
R281  68  R-US_R0603  [R0603]
R282  68  R-US_R0603  [R0603]
R283  68  R-US_R0603  [R0603]
R284  68  R-US_R0603  [R0603]
R285  68  R-US_R0603  [R0603]
R286  68  R-US_R0603  [R0603]
R287  68  R-US_R0603  [R0603]
R288  68  R-US_R0603  [R0603]
R289  68  R-US_R0603  [R0603]
R290  68  R-US_R0603  [R0603]
R291  68  R-US_R0603  [R0603]
R292  68  R-US_R0603  [R0603]
R293  68  R-US_R0603  [R0603]
R294  68  R-US_R0603  [R0603]
R295  68  R-US_R0603  [R0603]
R296  68  R-US_R0603  [R0603]
R297  68  R-US_R0603  [R0603]
R298  68  R-US_R0603  [R0603]
R299  68  R-US_R0603  [R0603]
R300  68  R-US_R0603  [R0603]
R301  68  R-US_R0603  [R0603]
R302  68  R-US_R0603  [R0603]
R303  68  R-US_R0603  [R0603]
R304  68  R-US_R0603  [R0603]
R305  68  R-US_R0603  [R0603]
R306  R_220R_0603  [R0603]
R307  R_220R_0603  [R0603]
R308  1k  R-US_R0603  [R0603]
R309  1k  R-US_R0603  [R0603]
R310  R_1K_0603  [R0603]
R311  1k  R-US_R0603  [R0603]
R312  1k  R-US_R0603  [R0603]
R313  1k  R-US_R0603  [R0603]
R314  1k  R-US_R0603  [R0603]
R315  1k  R-US_R0603  [R0603]
R316  1k  R-US_R0603  [R0603]
R317  1k  R-US_R0603  [R0603]
R318  1k  R-US_R0603  [R0603]
R319  1k  R-US_R0603  [R0603]
R320  1k  R-US_R0603  [R0603]
R321  1k  R-US_R0603  [R0603]
R322  1k  R-US_R0603  [R0603]
R323  1k  R-US_R0603  [R0603]
R324  1k  R-US_R0603  [R0603]
R325  1k  R-US_R0603  [R0603]
R326  1k  R-US_R0603  [R0603]
R327  1k  R-US_R0603  [R0603]
R328  1k  R-US_R0603  [R0603]
R329  1k  R-US_R0603  [R0603]
R330  1k  R-US_R0603  [R0603]
R331  1k  R-US_R0603  [R0603]
R332  1k  R-US_R0603  [R0603]
R333  1k  R-US_R0603  [R0603]
R334  1k  R-US_R0603  [R0603]
R335  1k  R-US_R0603  [R0603]
R336  1k  R-US_R0603  [R0603]
R337  1k  R-US_R0603  [R0603]
R338  1k  R-US_R0603  [R0603]
R339  1k  R-US_R0603  [R0603]
R340  1k  R-US_R0603  [R0603]
R341  1k  R-US_R0603  [R0603]
R342  1k  R-US_R0603  [R0603]
R343  1k  R-US_R0603  [R0603]
R344  1k  R-US_R0603  [R0603]
R345  1k  R-US_R0603  [R0603]
R346  1k  R-US_R0603  [R0603]
R347  1k  R-US_R0603  [R0603]
R348  1k  R-US_R0603  [R0603]
S1  MOMENTARY-SWITCH-SPST-PTH-6.0MM  [TACTILE_SWITCH_PTH_6.0MM]
S2  MOMENTARY-SWITCH-SPST-PTH-6.0MM  [TACTILE_SWITCH_PTH_6.0MM]
S3  MOMENTARY-SWITCH-SPST-PTH-6.0MM  [TACTILE_SWITCH_PTH_6.0MM]
S4  MOMENTARY-SWITCH-SPST-PTH-6.0MM  [TACTILE_SWITCH_PTH_6.0MM]
S5  MOMENTARY-SWITCH-SPST-PTH-6.0MM  [TACTILE_SWITCH_PTH_6.0MM]
STAR_1  B8B-PH-K  [B8B-PH-K]
STAR_2  B8B-PH-K  [B8B-PH-K]
STAR_3  B8B-PH-K  [B8B-PH-K]
STAR_4  B8B-PH-K  [B8B-PH-K]
STAR_5  B8B-PH-K  [B8B-PH-K]
STAR_6  B8B-PH-K  [B8B-PH-K]
STAR_7  B8B-PH-K  [B8B-PH-K]
STAR_8  B8B-PH-K  [B8B-PH-K]
STAR_9  B8B-PH-K  [B8B-PH-K]
STAR_10  B8B-PH-K  [B8B-PH-K]
STAR_11  B8B-PH-K  [B8B-PH-K]
STAR_12  B8B-PH-K  [B8B-PH-K]
STAR_13  B8B-PH-K  [B8B-PH-K]
STAR_14  B8B-PH-K  [B8B-PH-K]
STAR_15  B8B-PH-K  [B8B-PH-K]
STAR_16  B8B-PH-K  [B8B-PH-K]
STAR_17  B8B-PH-K  [B8B-PH-K]
STAR_18  B8B-PH-K  [B8B-PH-K]
STAR_19  B8B-PH-K  [B8B-PH-K]
STAR_20  B8B-PH-K  [B8B-PH-K]
U1  6N138SDM  [COUPL_6N138SDM]
U$1  ESP32DEVKITV1  [ESP32-DEVKITV1]
ULN2  ULN2803SOICW  [SO18L]

## Nets
2: JP2.2 U$1.4(IO2)
4: APA102.3 D196.2 U$1.5(IO4)
5: JP2.3 U$1.8(IO5)
12: JTAG.2 U$1.27(IO12)
13 [3V3]: C125.2 D94.A JTAG.3 R225.1 U$1.28(IO13)
14: JTAG.4 U$1.26(IO14)
15: JTAG.5 U$1.3(IO15)
16/RX2: IC1.1(RO) IC3.1(RO) IC4.1(RO) IC5.1(RO) IC6.1(RO) IC7.1(RO) IC8.1(RO) IC9.1(RO) IC10.1(RO) IC11.1(RO) IC12.1(RO) IC13.1(RO) IC14.1(RO) IC15.1(RO) IC16.1(RO) IC17.1(RO) IC18.1(RO) IC19.1(RO) IC20.1(RO) IC21.1(RO) JP1.2 U$1.6(IO16)
17/TX2: IC1.4(DI) IC3.4(DI) IC4.4(DI) IC5.4(DI) IC6.4(DI) IC7.4(DI) IC8.4(DI) IC9.4(DI) IC10.4(DI) IC11.4(DI) IC12.4(DI) IC13.4(DI) IC14.4(DI) IC15.4(DI) IC16.4(DI) IC17.4(DI) IC18.4(DI) IC19.4(DI) IC20.4(DI) IC21.4(DI) JP1.3 U$1.7(IO17)
18: APA102.2 D197.2 U$1.9(IO18)
19: J1.1 R307.1 R310.1 R310.2 U1.6(VO) U$1.10(IO19)
21/SDA: I2C.4 J1.7 NEBULA_A.13(SDA) NEBULA_B.13(SDA) NEBULA_C.13(SDA) NEBULA_D.13(SDA) NEBULA_E.13(SDA) NEBULA_F.13(SDA) NEBULA_G.13(SDA) NEBULA_H.13(SDA) R26.1 U$1.11(IO21)
22/SCL: I2C.3 J1.8 NEBULA_A.12(SCK) NEBULA_B.12(SCK) NEBULA_C.12(SCK) NEBULA_D.12(SCK) NEBULA_E.12(SCK) NEBULA_F.12(SCK) NEBULA_G.12(SCK) NEBULA_H.12(SCK) R27.1 U$1.14(IO22)
23: U$1.15(IO23) ULN2.8
25: U$1.23(IO25) ULN2.7
26: U$1.24(IO26) ULN2.6
27: U$1.25(IO27) ULN2.5
32: U$1.21(IO32) ULN2.4
33: J1.2 U$1.22(IO33)
34: J1.3 U$1.19(IO34)
35: J1.4 U$1.20(IO35)
36: J1.5 U$1.17(VP)
39: J1.6 NEBULA_H.19(INTB) U$1.18(VN)
+3V3 [3V3]: ACCESSORY_GPIO.5 C3.1 C7.1 C8.1 C9.1 C10.1 C11.1 C12.1 C13.1 C14.1 C15.1 C16.1 C17.1 C18.1 C19.1 C20.1 C21.1 C22.1 C23.1 C24.1 C25.1 C26.1 C27.1 C28.1 C29.1 C30.1 C31.1 C32.1 C33.1 C34.1 C36.1 C70.+ D91.A I2C.1 IC1.8(VCC) IC3.8(VCC) IC4.8(VCC) IC5.8(VCC) IC6.8(VCC) IC7.8(VCC) IC8.8(VCC) IC9.8(VCC) IC10.8(VCC) IC11.8(VCC) IC12.8(VCC) IC13.8(VCC) IC14.8(VCC) IC15.8(VCC) IC16.8(VCC) IC17.8(VCC) IC18.8(VCC) IC19.8(VCC) IC20.8(VCC) IC21.8(VCC) IC22.4(OUT) J1.9 JP2.4 NEBULA_A.9(VDD) NEBULA_A.18(!RESET) NEBULA_B.9(VDD) NEBULA_B.15(A0) NEBULA_B.18(!RESET) NEBULA_C.9(VDD) NEBULA_C.16(A1) NEBULA_C.18(!RESET) NEBULA_D.9(VDD) NEBULA_D.15(A0) NEBULA_D.16(A1) NEBULA_D.18(!RESET) NEBULA_E.9(VDD) NEBULA_E.17(A2) NEBULA_E.18(!RESET) NEBULA_F.9(VDD) NEBULA_F.15(A0) NEBULA_F.17(A2) NEBULA_F.18(!RESET) NEBULA_G.9(VDD) NEBULA_G.16(A1) NEBULA_G.17(A2) NEBULA_G.18(!RESET) NEBULA_H.9(VDD) NEBULA_H.15(A0) NEBULA_H.16(A1) NEBULA_H.17(A2) NEBULA_H.18(!RESET) R26.2 R27.2 R68.2 R133.1 R134.1 R135.1 R136.1 R137.1 R138.2 R220.1 R221.1 R222.1 R223.1 R224.1 R307.2 U$1.1(3V3)
+5V [5V]: APA102.4 C5.1 C69.+ C71.+ C130.1 D92.A IC2.4(OUT) POWER_IN.2 R125.1 R126.1 R127.1 R128.1 R129.1 U1.8(VCC) U$1.30(VIN)
+12V [12V]: ACCESSORY.5 C2.1 C4.1 C6.1 C35.1 C89.+ D93.A F1.2 IC2.3(IN) IC22.3(IN) ULN2.10
+14V [12V]: C90.+ F2.2 GAME_INTERFACE.12
A0: NEBULA_A.21(GPA0) R226.1
A1: NEBULA_A.22(GPA1) R227.1
A2: NEBULA_A.23(GPA2) R228.1
A3: NEBULA_A.24(GPA3) R229.1
A4: NEBULA_A.25(GPA4) R230.1
A5: NEBULA_A.26(GPA5) R231.1
A6: NEBULA_A.27(GPA6) R232.1
A7: NEBULA_A.28(GPA7) R233.1
A8: NEBULA_A.1(GPB0) R234.1
A9: NEBULA_A.2(GPB1) R235.1
A10: NEBULA_A.3(GPB2) R236.1
A11: NEBULA_A.4(GPB3) R237.1
A12: NEBULA_A.5(GPB4) R238.1
A13: NEBULA_A.6(GPB5) R239.1
A14: NEBULA_A.7(GPB6) R240.1
A15: NEBULA_A.8(GPB7) R241.1
B0: NEBULA_B.21(GPA0) R242.1
B1: NEBULA_B.22(GPA1) R243.1
B2: NEBULA_B.23(GPA2) R244.1
B3: NEBULA_B.24(GPA3) R245.1
B4: NEBULA_B.25(GPA4) R246.1
B5: NEBULA_B.26(GPA5) R247.1
B6: NEBULA_B.27(GPA6) R248.1
B7: NEBULA_B.28(GPA7) R249.1
B8: NEBULA_B.1(GPB0) R250.1
B9: NEBULA_B.2(GPB1) R251.1
B10: NEBULA_B.3(GPB2) R252.1
B11: NEBULA_B.4(GPB3) R253.1
B12: NEBULA_B.5(GPB4) R254.1
B13: NEBULA_B.6(GPB5) R255.1
B14: NEBULA_B.7(GPB6) R256.1
B15: NEBULA_B.8(GPB7) R257.1
C0: NEBULA_C.21(GPA0) R258.1
C1: NEBULA_C.22(GPA1) R259.1
C2: NEBULA_C.23(GPA2) R260.1
C3: NEBULA_C.24(GPA3) R261.1
C4: NEBULA_C.25(GPA4) R262.1
C5: NEBULA_C.26(GPA5) R263.1
C6: NEBULA_C.27(GPA6) R264.1
C7: NEBULA_C.28(GPA7) R265.1
C8: NEBULA_C.1(GPB0) R266.1
C9: NEBULA_C.2(GPB1) R267.1
C10: NEBULA_C.3(GPB2) R268.1
C11: NEBULA_C.4(GPB3) R269.1
C12: NEBULA_C.5(GPB4) R270.1
C13: NEBULA_C.6(GPB5) R271.1
C14: NEBULA_C.7(GPB6) R272.1
C15: NEBULA_C.8(GPB7) R273.1
D0: NEBULA_D.21(GPA0) R274.1
D1: NEBULA_D.22(GPA1) R275.1
D2: NEBULA_D.23(GPA2) R276.1
D3: NEBULA_D.24(GPA3) R277.1
D4: NEBULA_D.25(GPA4) R278.1
D5: NEBULA_D.26(GPA5) R279.1
D6: NEBULA_D.27(GPA6) R280.1
D7: NEBULA_D.28(GPA7) R281.1
D8: NEBULA_D.1(GPB0) R282.1
D9: NEBULA_D.2(GPB1) R283.1
D10: NEBULA_D.3(GPB2) R284.1
D11: NEBULA_D.4(GPB3) R285.1
D12: NEBULA_D.5(GPB4) R286.1
D13: NEBULA_D.6(GPB5) R287.1
D14: NEBULA_D.7(GPB6) R288.1
D15: NEBULA_D.8(GPB7) R289.1
E0: NEBULA_E.21(GPA0) R290.1
E1: NEBULA_E.22(GPA1) R291.1
E2: NEBULA_E.23(GPA2) R292.1
E3: NEBULA_E.24(GPA3) R293.1
E4: NEBULA_E.25(GPA4) R294.1
E5: NEBULA_E.26(GPA5) R295.1
E6: NEBULA_E.27(GPA6) R296.1
E7: NEBULA_E.28(GPA7) R297.1
E8: NEBULA_E.1(GPB0) R298.1
E9: NEBULA_E.2(GPB1) R299.1
E10: NEBULA_E.3(GPB2) R300.1
E11: NEBULA_E.4(GPB3) R301.1
E12: NEBULA_E.5(GPB4) R302.1
E13: NEBULA_E.6(GPB5) R303.1
E14: NEBULA_E.7(GPB6) R304.1
E15: NEBULA_E.8(GPB7) R305.1
F0: IC1.2(RE/) NEBULA_F.21(GPA0) R309.1
F1: IC1.3(DE) NEBULA_F.22(GPA1) R308.1
F2: IC3.2(RE/) NEBULA_F.23(GPA2) R312.1
F3: IC3.3(DE) NEBULA_F.24(GPA3) R311.1
F4: IC4.2(RE/) NEBULA_F.25(GPA4) R314.1
F5: IC4.3(DE) NEBULA_F.26(GPA5) R313.1
F6: IC5.2(RE/) NEBULA_F.27(GPA6) R316.1
F7: IC5.3(DE) NEBULA_F.28(GPA7) R315.1
F8: IC6.2(RE/) NEBULA_F.1(GPB0) R318.1
F9: IC6.3(DE) NEBULA_F.2(GPB1) R317.1
F10: IC7.2(RE/) NEBULA_F.3(GPB2) R320.1
F11: IC7.3(DE) NEBULA_F.4(GPB3) R319.1
F12: IC8.2(RE/) NEBULA_F.5(GPB4) R322.1
F13: IC8.3(DE) NEBULA_F.6(GPB5) R321.1
F14: IC9.2(RE/) NEBULA_F.7(GPB6) R324.1
F15: IC9.3(DE) NEBULA_F.8(GPB7) R323.1
G0: IC10.2(RE/) NEBULA_G.21(GPA0) R326.1
G1: IC10.3(DE) NEBULA_G.22(GPA1) R325.1
G2: IC11.2(RE/) NEBULA_G.23(GPA2) R328.1
G3: IC11.3(DE) NEBULA_G.24(GPA3) R327.1
G4: IC12.2(RE/) NEBULA_G.25(GPA4) R330.1
G5: IC12.3(DE) NEBULA_G.26(GPA5) R329.1
G6: IC13.2(RE/) NEBULA_G.27(GPA6) R332.1
G7: IC13.3(DE) NEBULA_G.28(GPA7) R331.1
G8: IC14.2(RE/) NEBULA_G.1(GPB0) R334.1
G9: IC14.3(DE) NEBULA_G.2(GPB1) R333.1
G10: IC15.2(RE/) NEBULA_G.3(GPB2) R336.1
G11: IC15.3(DE) NEBULA_G.4(GPB3) R335.1
G12: IC16.2(RE/) NEBULA_G.5(GPB4) R338.1
G13: IC16.3(DE) NEBULA_G.6(GPB5) R337.1
G14: IC17.2(RE/) NEBULA_G.7(GPB6) R340.1
G15: IC17.3(DE) NEBULA_G.8(GPB7) R339.1
GND [GND]: ACCESSORY.1 ACCESSORY_GPIO.1 APA102.1 C1.2 C2.2 C3.2 C4.2 C5.2 C6.2 C7.2 C8.2 C9.2 C10.2 C11.2 C12.2 C13.2 C14.2 C15.2 C16.2 C17.2 C18.2 C19.2 C20.2 C21.2 C22.2 C23.2 C24.2 C25.2 C26.2 C27.2 C28.2 C29.2 C30.2 C31.2 C32.2 C33.2 C34.2 C35.2 C36.2 C37.2 C38.2 C39.2 C40.2 C41.2 C42.2 C43.2 C44.2 C45.2 C46.2 C47.2 C48.2 C49.2 C50.2 C51.2 C52.2 C53.2 C54.2 C55.2 C56.2 C57.2 C58.2 C59.2 C60.2 C61.2 C62.2 C63.2 C64.2 C65.2 C66.2 C67.2 C68.2 C69.- C70.- C71.- C73.2 C74.2 C75.2 C76.2 C77.2 C78.2 C79.2 C80.2 C81.2 C82.2 C83.2 C84.2 C85.2 C86.2 C87.2 C88.2 C89.- C90.- C93.2 C94.2 C95.2 C96.2 C97.2 C98.2 C99.2 C100.2 C101.2 C102.2 C103.2 C104.2 C105.2 C106.2 C107.2 C108.2 C109.2 C110.2 C111.2 C112.2 C113.2 C114.2 C115.2 C116.2 C117.2 C118.2 C119.2 C120.2 C121.2 C122.2 C123.2 C124.2 C125.1 C126.2 C127.2 C130.2 D1.C D2.C D3.C D4.C D5.C D6.C D7.C D8.C D9.C D10.C D11.C D12.C D13.C D14.C D15.C D16.C D17.C D18.C D19.C D20.C D21.C D22.C D23.C D24.C D25.C D26.C D27.C D28.C D29.C D30.C D31.C D32.C D33.C D34.C D35.C D36.C D37.C D38.C D39.C D40.C D41.C D42.C D43.C D44.C D45.C D46.C D47.C D48.C D49.C D50.C D51.C D52.C D53.C D54.C D55.C D56.C D57.C D58.C D59.C D60.C D61.C D62.C D63.C D64.C D65.C D66.C D67.C D68.C D69.C D70.C D71.C D72.C D73.C D74.C D75.C D76.C D77.C D78.C D79.C D80.C D115.1 D116.1 D117.1 D118.1 D119.1 D120.1 D121.1 D122.1 D123.1 D124.1 D125.1 D126.1 D127.1 D128.1 D129.1 D130.1 D131.1 D132.1 D133.1 D134.1 D135.1 D136.1 D137.1 D138.1 D139.1 D140.1 D141.1 D142.1 D143.1 D144.1 D145.1 D146.1 D147.1 D148.1 D149.1 D150.1 D151.1 D152.1 D153.1 D154.1 D155.1 D156.1 D157.1 D158.1 D159.1 D160.1 D161.1 D162.1 D163.1 D164.1 D165.1 D166.1 D167.1 D168.1 D169.1 D170.1 D171.1 D172.1 D173.1 D174.1 D175.1 D176.1 D177.1 D178.1 D179.1 D180.1 D181.1 D182.1 D183.1 D184.1 D185.1 D186.1 D187.1 D188.1 D189.1 D190.1 D191.1 D192.1 D193.1 D194.1 D195.1 D196.1 D197.1 D199.C D200.C D201.C D202.C D203.C D204.C D205.C D206.C D207.C D208.C D209.C D210.C D211.C D212.C D213.C D214.C D215.C D216.C D217.C D218.C D219.C D220.C D221.C D222.C D223.C D224.C D225.C D226.C D227.C D228.C D229.C D230.C D231.C D232.C D233.C D234.C D235.C D236.C D237.C D238.C GAME_INTERFACE.1 I2C.2 IC1.5(GND) IC2.1(ADJ) IC3.5(GND) IC4.5(GND) IC5.5(GND) IC6.5(GND) IC7.5(GND) IC8.5(GND) IC9.5(GND) IC10.5(GND) IC11.5(GND) IC12.5(GND) IC13.5(GND) IC14.5(GND) IC15.5(GND) IC16.5(GND) IC17.5(GND) IC18.5(GND) IC19.5(GND) IC20.5(GND) IC21.5(GND) IC22.1(ADJ) J1.10 JP1.1 JP2.1 JP3.1 JP3.2 JP3.3 JP3.4 JP4.1 JP4.2 JP4.3 JP4.4 JTAG.1 NEBULA_A.10(VSS) NEBULA_A.15(A0) NEBULA_A.16(A1) NEBULA_A.17(A2) NEBULA_B.10(VSS) NEBULA_B.16(A1) NEBULA_B.17(A2) NEBULA_C.10(VSS) NEBULA_C.15(A0) NEBULA_C.17(A2) NEBULA_D.10(VSS) NEBULA_D.17(A2) NEBULA_E.10(VSS) NEBULA_E.15(A0) NEBULA_E.16(A1) NEBULA_F.10(VSS) NEBULA_F.16(A1) NEBULA_G.10(VSS) NEBULA_G.15(A0) NEBULA_H.10(VSS) POWER_IN.1 POWER_IN.3 R67.2 R130.2 R131.2 R132.2 R139.2 S1.3 S2.3 S3.3 S4.3 S5.3 STAR_1.1 STAR_2.1 STAR_3.1 STAR_4.1 STAR_5.1 STAR_6.1 STAR_7.1 STAR_8.1 STAR_9.1 STAR_10.1 STAR_11.1 STAR_12.1 STAR_13.1 STAR_14.1 STAR_15.1 STAR_16.1 STAR_17.1 STAR_18.1 STAR_19.1 STAR_20.1 U1.5(GND) U$1.2(GND) U$1.29(GND1) ULN2.9
H0: IC18.2(RE/) NEBULA_H.21(GPA0) R342.1
H1: IC18.3(DE) NEBULA_H.22(GPA1) R341.1
H2: IC19.2(RE/) NEBULA_H.23(GPA2) R344.1
H3: IC19.3(DE) NEBULA_H.24(GPA3) R343.1
H4: IC20.2(RE/) NEBULA_H.25(GPA4) R346.1
H5: IC20.3(DE) NEBULA_H.26(GPA5) R345.1
H6: IC21.2(RE/) NEBULA_H.27(GPA6) R348.1
H7: IC21.3(DE) NEBULA_H.28(GPA7) R347.1
H8: D86.C GAME_INTERFACE.2 NEBULA_H.1(GPB0) R137.2 S1.1
H9: D87.C GAME_INTERFACE.3 NEBULA_H.2(GPB1) R136.2 S2.1
H10: D88.C GAME_INTERFACE.4 NEBULA_H.3(GPB2) R135.2 S3.1
H11: D90.C GAME_INTERFACE.5 NEBULA_H.4(GPB3) R134.2 S4.1
H12: D89.C GAME_INTERFACE.6 NEBULA_H.5(GPB4) R133.2 S5.1
H13: ACCESSORY_GPIO.2 NEBULA_H.6(GPB5) ULN2.3
H14: ACCESSORY_GPIO.3 NEBULA_H.7(GPB6) ULN2.2
H15: ACCESSORY_GPIO.4 NEBULA_H.8(GPB7) ULN2.1
N$1: C1.1 U$1.16(EN)
N$2: D98.A R57.2
N$3: D2.A R3.2
N$4: D3.A R4.2
N$5: D4.A R5.2
N$6: D5.A R6.2
N$7: D98.C STAR_4.6
N$8: D97.A R56.2
N$9: D95.A R54.2
N$10: D102.A R61.2
N$11: D6.A R7.2
N$12: D7.A R8.2
N$13: D8.A R9.2
N$14: D9.A R10.2
N$15: D102.C STAR_8.6
N$16: D101.A R60.2
N$17: D101.C STAR_7.6
N$18: D103.A R62.2
N$19: D103.C STAR_9.6
N$20: D14.A R15.2
N$21: D15.A R16.2
N$22: D16.A R17.2
N$23: D17.A R18.2
N$24: D104.A R83.2
N$25: D104.C STAR_13.6
N$26: D56.A R74.2
N$27: D55.A R73.2
N$28: D13.A R14.2
N$29: D12.A R13.2
N$30: D11.A R12.2
N$31: D10.A R11.2
N$32: D54.A R72.2
N$33: D53.A R71.2
N$34: D80.A R102.2
N$35: D1.A R53.2
N$36: D25.A R28.2
N$37: D24.A R25.2
N$38: D23.A R24.2
N$39: D22.A R23.2
N$40: D50.A R66.2
N$41: D51.A R69.2
N$42: D52.A R70.2
N$43: D61.A R79.2
N$44: D21.A R22.2
N$45: D20.A R21.2
N$46: D19.A R20.2
N$47: D18.A R19.2
N$48: D62.A R80.2
N$49: D63.A R81.2
N$50: D64.A R82.2
N$51: D81.C GAME_INTERFACE.7 ULN2.11
N$52: D26.A R29.2
N$53: D27.A R30.2
N$54: D28.A R31.2
N$55: D29.A R32.2
N$56: D82.C GAME_INTERFACE.8 ULN2.12
N$57: D83.C GAME_INTERFACE.9 ULN2.13
N$58: D85.C GAME_INTERFACE.10 ULN2.14
N$59: D84.C GAME_INTERFACE.11 ULN2.15
N$60: D30.A R33.2
N$61: D31.A R34.2
N$62: D32.A R35.2
N$63: D33.A R36.2
N$64: D57.A R75.2
N$65: D58.A R76.2
N$66: D59.A R77.2
N$67: D60.A R78.2
N$68: D34.A R37.2
N$69: D35.A R38.2
N$70: D36.A R39.2
N$71: D37.A R40.2
N$72: D106.A R63.2
N$73: D106.C STAR_10.6
N$74: D107.A R64.2
N$75: D107.C STAR_11.6
N$76: D38.A R41.2
N$77: D39.A R42.2
N$78: D40.A R43.2
N$79: D41.A R44.2
N$80: D79.A R101.2
N$81: D78.A R100.2
N$82: D77.A R99.2
N$83: D76.A R98.2
N$84: D199.A R308.2
N$85: D42.A R45.2
N$86: D43.A R46.2
N$87: D44.A R47.2
N$88: D75.A R97.2
N$89 [3V3]: ESTOP.2 ESTOP_2.2 R68.1 R138.1
N$90: D74.A R96.2
N$91: D73.A R95.2
N$92: D65.A R87.2
N$93: D45.A R48.2
N$94: D46.A R49.2
N$95: D47.A R50.2
N$96: D48.A R51.2
N$97: D66.A R88.2
N$98: D67.A R89.2
N$99: D68.A R90.2
N$100: D69.A R91.2
N$101: D70.A R92.2
N$102: D71.A R93.2
N$103: D72.A R94.2
N$104: D108.A R65.2
N$105: D108.C STAR_12.6
N$106: D111.A R86.2
N$107: D111.C STAR_16.6
N$108: IC1.7(B) R1.2 STAR_1.7
N$109: IC1.6(A) R1.1 STAR_1.8
N$110: IC3.7(B) R2.2 STAR_2.7
N$111: IC3.6(A) R2.1 STAR_2.8
N$112: IC4.7(B) R107.2 STAR_3.7
N$113: IC4.6(A) R107.1 STAR_3.8
N$114: IC5.7(B) R108.2 STAR_4.7
N$115: IC5.6(A) R108.1 STAR_4.8
N$116: IC6.7(B) R109.2 STAR_5.7
N$117: IC6.6(A) R109.1 STAR_5.8
N$118: IC7.7(B) R110.2 STAR_6.7
N$119: IC7.6(A) R110.1 STAR_6.8
N$120: IC8.7(B) R111.2 STAR_7.7
N$121: IC8.6(A) R111.1 STAR_7.8
N$122: IC9.7(B) R112.2 STAR_8.7
N$123: IC9.6(A) R112.1 STAR_8.8
N$124: IC10.7(B) R113.2 STAR_9.7
N$125: IC10.6(A) R113.1 STAR_9.8
N$126: IC11.7(B) R114.2 STAR_10.7
N$127: IC11.6(A) R114.1 STAR_10.8
N$128: IC12.7(B) R115.2 STAR_11.7
N$129: IC12.6(A) R115.1 STAR_11.8
N$130: IC13.7(B) R116.2 STAR_12.7
N$131: IC13.6(A) R116.1 STAR_12.8
N$132: IC14.7(B) R117.2 STAR_13.7
N$133: IC14.6(A) R117.1 STAR_13.8
N$134: IC15.7(B) R118.2 STAR_14.7
N$135: IC15.6(A) R118.1 STAR_14.8
N$136: IC16.7(B) R119.2 STAR_15.7
N$137: IC16.6(A) R119.1 STAR_15.8
N$138: IC17.7(B) R120.2 STAR_16.7
N$139: IC17.6(A) R120.1 STAR_16.8
N$140: IC18.7(B) R121.2 STAR_17.7
N$141: IC18.6(A) R121.1 STAR_17.8
N$142: IC19.7(B) R122.2 STAR_18.7
N$143: IC19.6(A) R122.1 STAR_18.8
N$144: IC20.7(B) R123.2 STAR_19.7
N$145: IC20.6(A) R123.1 STAR_19.8
N$146: IC21.7(B) R124.2 STAR_20.7
N$147: IC21.6(A) R124.1 STAR_20.8
N$148: ACCESSORY.2 ULN2.16
N$149: ACCESSORY.3 ULN2.17
N$150: ACCESSORY.4 ULN2.18
N$151: D84.A R129.2
N$152: D85.A R128.2
N$153: D83.A R127.2
N$154: D82.A R126.2
N$155: D81.A R125.2
N$156: D91.C R130.1
N$157: D92.C R131.1
N$158: D93.C R132.1
N$159: D94.C R139.1
N$160: C37.1 D116.2 R3.1 R143.1 R226.2
N$161: C38.1 D115.2 R4.1 R142.1 R227.2
N$162: C39.1 D117.2 R5.1 R141.1 R228.2
N$163: C40.1 D118.2 R6.1 R140.1 R229.2
N$164: C44.1 D122.2 R10.1 R144.1 R233.2
N$165: C43.1 D121.2 R9.1 R145.1 R232.2
N$166: C42.1 D120.2 R8.1 R146.1 R231.2
N$167: C41.1 D119.2 R7.1 R147.1 R230.2
N$168: R143.2 STAR_1.2
N$169: R142.2 STAR_1.3
N$170: R141.2 STAR_1.4
N$171: R140.2 STAR_1.5
N$172: R147.2 STAR_2.2
N$173: R146.2 STAR_2.3
N$174: R145.2 STAR_2.4
N$175: R144.2 STAR_2.5
N$176: R151.2 STAR_3.2
N$177: R150.2 STAR_3.3
N$178: R149.2 STAR_3.4
N$179: R148.2 STAR_3.5
N$180: R155.2 STAR_4.2
N$181: R154.2 STAR_4.3
N$182: R153.2 STAR_4.4
N$183: R152.2 STAR_4.5
N$184: D49.A R52.2
N$185: C46.1 D124.2 R12.1 R150.1 R235.2
N$186: C47.1 D125.2 R13.1 R149.1 R236.2
N$187: C48.1 D126.2 R14.1 R148.1 R237.2
N$188: C52.1 D130.2 R18.1 R152.1 R241.2
N$189: C51.1 D129.2 R17.1 R153.1 R240.2
N$190: C50.1 D128.2 R16.1 R154.1 R239.2
N$191: C49.1 D127.2 R15.1 R155.1 R238.2
N$192 [GND]: C53.1 D131.2 R19.1 R159.1 R242.2
N$193 [GND]: C56.1 D134.2 R22.1 R156.1 R245.2
N$194 [GND]: C55.1 D133.2 R21.1 R157.1 R244.2
N$195 [GND]: C54.1 D132.2 R20.1 R158.1 R243.2
N$196: C60.1 D138.2 R28.1 R160.1 R249.2
N$197: C59.1 D137.2 R25.1 R161.1 R248.2
N$198: C58.1 D136.2 R24.1 R162.1 R247.2
N$199: C57.1 D135.2 R23.1 R163.1 R246.2
N$200: R159.2 STAR_5.2
N$201: R158.2 STAR_5.3
N$202: R157.2 STAR_5.4
N$203: R156.2 STAR_5.5
N$204: R163.2 STAR_6.2
N$205: R162.2 STAR_6.3
N$206: R161.2 STAR_6.4
N$207: R160.2 STAR_6.5
N$208: R167.2 STAR_7.2
N$209: R166.2 STAR_7.3
N$210: R165.2 STAR_7.4
N$211: R164.2 STAR_7.5
N$212: R171.2 STAR_8.2
N$213: R170.2 STAR_8.3
N$214: R169.2 STAR_8.4
N$215: R168.2 STAR_8.5
N$216: C61.1 D139.2 R29.1 R167.1 R250.2
N$217: C62.1 D140.2 R30.1 R166.1 R251.2
N$218: C63.1 D141.2 R31.1 R165.1 R252.2
N$219: C64.1 D142.2 R32.1 R164.1 R253.2
N$220: C68.1 D146.2 R36.1 R168.1 R257.2
N$221: C67.1 D145.2 R35.1 R169.1 R256.2
N$222: C66.1 D144.2 R34.1 R170.1 R255.2
N$223: C65.1 D143.2 R33.1 R171.1 R254.2
N$224: R175.2 STAR_9.2
N$225: R179.2 STAR_10.2
N$226: R178.2 STAR_10.3
N$227: R174.2 STAR_9.3
N$228: R173.2 STAR_9.4
N$229: R172.2 STAR_9.5
N$230: R177.2 STAR_10.4
N$231: R176.2 STAR_10.5
N$232: R183.2 STAR_11.2
N$233: R182.2 STAR_11.3
N$234: R181.2 STAR_11.4
N$235: R180.2 STAR_11.5
N$236: R187.2 STAR_12.2
N$237: R186.2 STAR_12.3
N$238: R185.2 STAR_12.4
N$239: R184.2 STAR_12.5
N$240: C73.1 D147.2 R37.1 R175.1 R258.2
N$241: C74.1 D148.2 R38.1 R174.1 R259.2
N$242: C75.1 D149.2 R39.1 R173.1 R260.2
N$243: C76.1 D150.2 R40.1 R172.1 R261.2
N$244: R191.2 STAR_13.2
N$245: C79.1 D153.2 R43.1 R177.1 R264.2
N$246: C78.1 D152.2 R42.1 R178.1 R263.2
N$247: C77.1 D151.2 R41.1 R179.1 R262.2
N$248: C81.1 D155.2 R45.1 R183.1 R266.2
N$249: C82.1 D156.2 R46.1 R182.1 R267.2
N$250: C83.1 D157.2 R47.1 R181.1 R268.2
N$251: C84.1 D158.2 R48.1 R180.1 R269.2
N$252: C80.1 D154.2 R44.1 R176.1 R265.2
N$253: C87.1 D161.2 R51.1 R185.1 R272.2
N$254: C86.1 D160.2 R50.1 R186.1 R271.2
N$255: C85.1 D159.2 R49.1 R187.1 R270.2
N$256: R190.2 STAR_13.3
N$257: R189.2 STAR_13.4
N$258: R188.2 STAR_13.5
N$259: R196.2 STAR_14.2
N$260: C88.1 D162.2 R52.1 R184.1 R273.2
N$261: R195.2 STAR_14.3
N$262: R194.2 STAR_14.4
N$263: R193.2 STAR_14.5
N$264: R199.2 STAR_15.2
N$265: R198.2 STAR_15.3
N$266: R192.2 STAR_15.5
N$267: R197.2 STAR_15.4
N$268: R203.2 STAR_16.2
N$269: R202.2 STAR_16.3
N$270: R201.2 STAR_16.4
N$271: R200.2 STAR_16.5
N$272: R216.2 STAR_20.5
N$273: R217.2 STAR_20.4
N$274: R218.2 STAR_20.3
N$275: R219.2 STAR_20.2
N$276: R212.2 STAR_19.5
N$277: R213.2 STAR_19.4
N$278: R214.2 STAR_19.3
N$279: R215.2 STAR_19.2
N$280: R208.2 STAR_18.5
N$281: R209.2 STAR_18.4
N$282: R210.2 STAR_18.3
N$283: R211.2 STAR_18.2
N$284: R204.2 STAR_17.5
N$285: R205.2 STAR_17.4
N$286: R206.2 STAR_17.3
N$287: R207.2 STAR_17.2
N$288: C97.1 D172.2 R75.1 R199.1 R282.2
N$289: C98.1 D173.2 R76.1 R198.1 R283.2
N$290: C99.1 D174.2 R77.1 R197.1 R284.2
N$291: C100.1 D175.2 R78.1 R192.1 R285.2
N$292: C108.1 D179.2 R82.1 R200.1 R289.2
N$293: C107.1 D178.2 R81.1 R201.1 R288.2
N$294: C106.1 D177.2 R80.1 R202.1 R287.2
N$295: C105.1 D176.2 R79.1 R203.1 R286.2
N$296: C93.1 D163.2 R53.1 R191.1 R274.2
N$297: C94.1 D164.2 R66.1 R190.1 R275.2
N$298: C95.1 D165.2 R69.1 R189.1 R276.2
N$299: C96.1 D166.2 R70.1 R188.1 R277.2
N$300: C104.1 D170.2 R74.1 R193.1 R281.2
N$301: C103.1 D169.2 R73.1 R194.1 R280.2
N$302: C102.1 D168.2 R72.1 R195.1 R279.2
N$303: C101.1 D167.2 R71.1 R196.1 R278.2
N$304: C109.1 D180.2 R87.1 R207.1 R290.2
N$305: C110.1 D181.2 R88.1 R206.1 R291.2
N$306: C111.1 D182.2 R89.1 R205.1 R292.2
N$307: C112.1 D183.2 R90.1 R204.1 R293.2
N$308: C116.1 D187.2 R94.1 R208.1 R297.2
N$309: C115.1 D186.2 R93.1 R209.1 R296.2
N$310: C114.1 D185.2 R92.1 R210.1 R295.2
N$311: C113.1 D184.2 R91.1 R211.1 R294.2
N$312: C117.1 D188.2 R95.1 R215.1 R298.2
N$313: C118.1 D189.2 R96.1 R214.1 R299.2
N$314: C119.1 D190.2 R97.1 R213.1 R300.2
N$315: C120.1 D191.2 R98.1 R212.1 R301.2
N$316: C124.1 D195.2 R102.1 R216.1 R305.2
N$317: C123.1 D194.2 R101.1 R217.1 R304.2
N$318: C122.1 D193.2 R100.1 R218.1 R303.2
N$319: C121.1 D192.2 R99.1 R219.1 R302.2
N$320: D86.A R220.2
N$321: D87.A R221.2
N$322: D88.A R222.2
N$323: D90.A R223.2
N$324: D89.A R224.2
N$325: D95.C STAR_1.6
N$326: D97.C STAR_3.6
N$327: D96.A R55.2
N$328: D96.C STAR_2.6
N$329: D100.A R59.2
N$330: D100.C STAR_6.6
N$331: D99.A R58.2
N$332: D99.C STAR_5.6
N$333: D110.A R85.2
N$334: D110.C STAR_15.6
N$335: D109.A R84.2
N$336: D109.C STAR_14.6
N$337: D105.A R103.2
N$338: D105.C STAR_17.6
N$339: D112.A R104.2
N$340: D112.C STAR_18.6
N$341: D113.A R105.2
N$342: D113.C STAR_19.6
N$343: D114.A R106.2
N$344: D114.C STAR_20.6
N$345: C45.1 D123.2 R11.1 R151.1 R234.2
N$346 [12V]: F1.1 F2.1 POWER_IN.4
N$347: D198.A R306.2 U1.3(C)
N$348: C126.1 MIDI_IN.1
N$349: C127.1 MIDI_IN.2
N$350: D200.A R309.2
N$351: D201.A R311.2
N$352: MIDI_IN.3 R306.1
N$353: D198.C MIDI_IN.4 U1.2(A)
N$354: D202.A R312.2
N$355: D203.A R313.2
N$356: D204.A R314.2
N$357: D205.A R315.2
N$358: D206.A R316.2
N$359: D207.A R317.2
N$360: D208.A R318.2
N$361: D209.A R319.2
N$362: D210.A R320.2
N$363: D211.A R321.2
N$364: D212.A R322.2
N$365: D213.A R323.2
N$366: D214.A R324.2
N$367: D215.A R325.2
N$368: D216.A R326.2
N$369: D217.A R327.2
N$370: D218.A R328.2
N$371: D219.A R329.2
N$372: D220.A R330.2
N$373: D221.A R331.2
N$374: D222.A R332.2
N$375: D223.A R333.2
N$376: D224.A R334.2
N$377: D225.A R335.2
N$378: D226.A R336.2
N$379: D227.A R337.2
N$380: D228.A R338.2
N$381: D229.A R339.2
N$382: D230.A R340.2
N$383: D231.A R341.2
N$384: D232.A R342.2
N$385: D233.A R343.2
N$386: D234.A R344.2
N$387: D235.A R345.2
N$388: D236.A R346.2
N$389: D237.A R347.2
N$390: D238.A R348.2
STAR_ENABLE: D171.2 ESTOP.1 ESTOP_2.1 R54.1 R55.1 R56.1 R57.1 R58.1 R59.1 R60.1 R61.1 R62.1 R63.1 R64.1 R65.1 R67.1 R83.1 R84.1 R85.1 R86.1 R103.1 R104.1 R105.1 R106.1 R225.2
Unconnected: NEBULA_A.19(INTB) NEBULA_A.20(INTA) NEBULA_B.19(INTB) NEBULA_B.20(INTA) NEBULA_C.19(INTB) NEBULA_C.20(INTA) NEBULA_D.19(INTB) NEBULA_D.20(INTA) NEBULA_E.19(INTB) NEBULA_E.20(INTA) NEBULA_F.19(INTB) NEBULA_F.20(INTA) NEBULA_G.19(INTB) NEBULA_G.20(INTA) NEBULA_H.20(INTA) U1.7(VB) U$1.12(IO3) U$1.13(IO1)

## Buses
ESP32_BUS:+3V3,+5V,2,4,5,12,13,14,15,16/RX2,17/TX2,18,19,20,21/SDA,22/SCL,23,25,26,27,32,33,34,35,36,39,GND
NEBULA:A[0..15],B[0..15],C[0..15],D[0..15],E[0..15],F[0..15],G[0..15],H[0..15]

## Notes on the sheet
- MIDI-IN Interface
- Midi Connector:
    4 In - Jack 5 (Signal Data)
    3 In - Jack 4 (Signal Power)
    2 In - Jack 2 (RF ground)
    1 In - Jack Shield (RF ground)
- i2c 0x20 | i2c 0x21 | i2c 0x22 | i2c 0x23 | i2c 0x24 | i2c 0x25 | i2c 0x26 | i2c 0x27